# Altium project Thrust Stand + Wind Tunnel Controller.PrjPcb
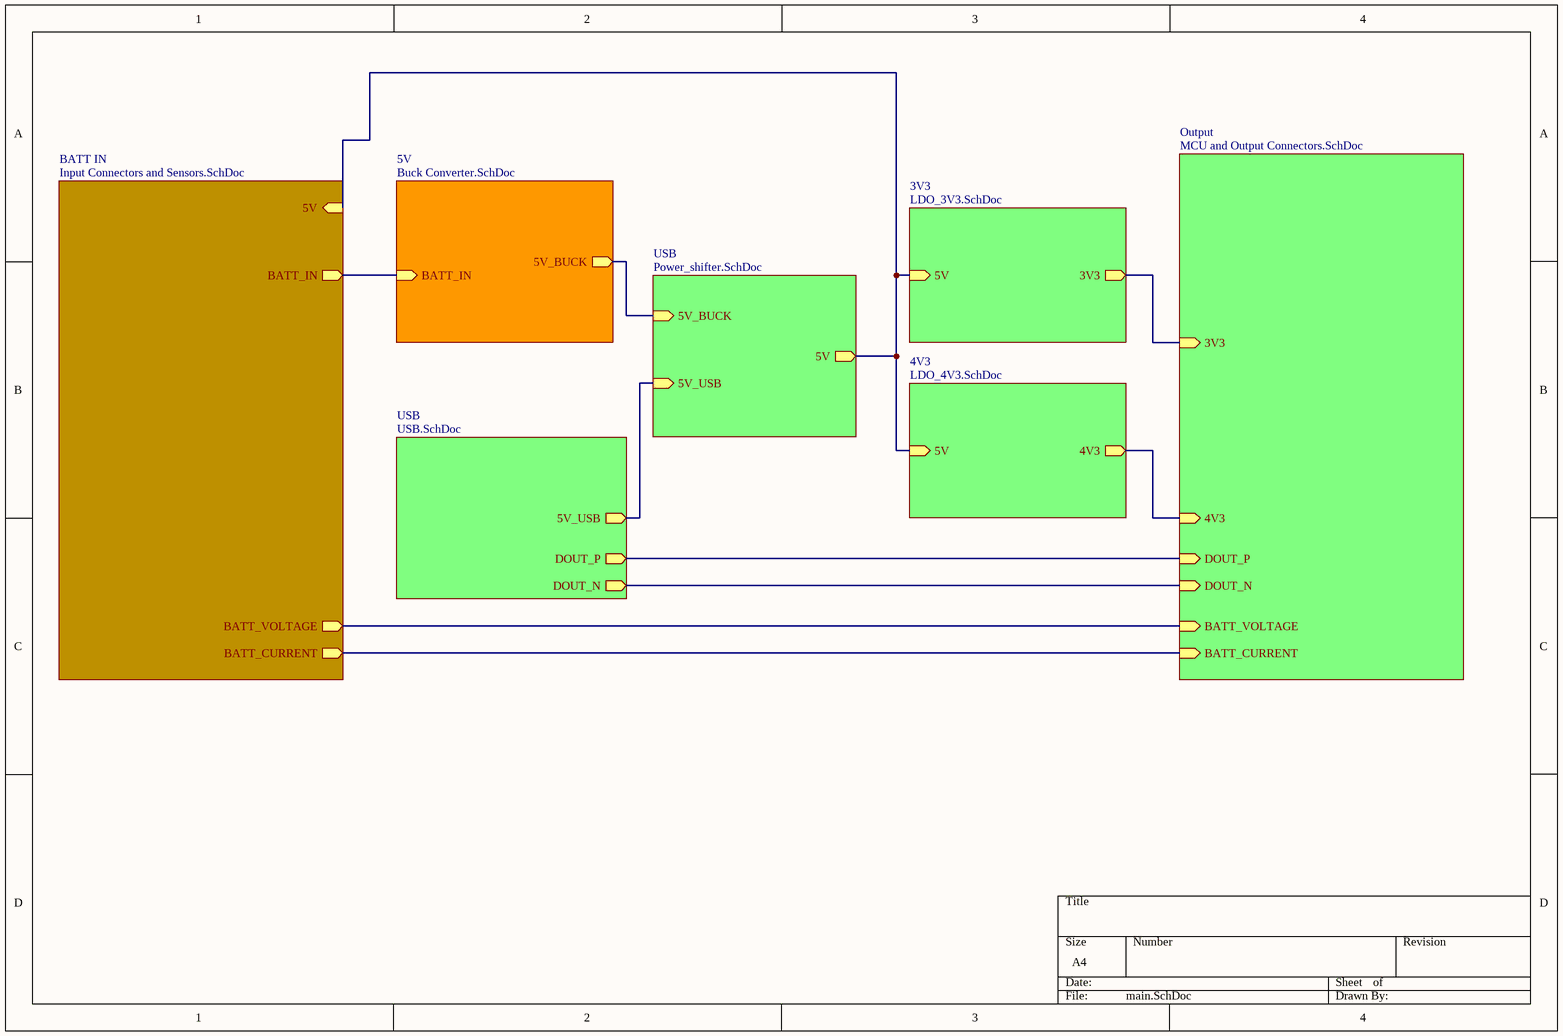
[diagram p0: main.SchDoc]
8 sheets, 159 parts. Net scope: hierarchical (ports join the sheet entries above them; power ports are global).
Board file: Thrust Stand + Wind Tunnel Controller.PcbDoc
Sheets:
  main.SchDoc
    BATT IN = Input Connectors and Sensors.SchDoc
    5V = Buck Converter.SchDoc
    3V3 = LDO_3V3.SchDoc
    Output = MCU and Output Connectors.SchDoc
    4V3 = LDO_4V3.SchDoc
    USB = USB.SchDoc
    USB = Power_shifter.SchDoc

## Sheet main.SchDoc
size A4; SheetNumber: 1; SheetTotal: 7

### Sub-sheets
3V3 = LDO_3V3.SchDoc: 5V (in), 3V3 (out)
4V3 = LDO_4V3.SchDoc: 5V (in), 4V3 (out)
5V = Buck Converter.SchDoc: BATT_IN (in), 5V_BUCK (out)
BATT IN = Input Connectors and Sensors.SchDoc: BATT_IN (out), 5V (in), BATT_CURRENT (out), BATT_VOLTAGE (out)
Output = MCU and Output Connectors.SchDoc: 3V3 (in), 4V3 (in), BATT_CURRENT (in), BATT_VOLTAGE (in), DOUT_P (in), DOUT_N (in)
USB = USB.SchDoc: 5V_USB (out), DOUT_P (out), DOUT_N (out)
USB = Power_shifter.SchDoc: 5V_USB (in), 5V_BUCK (in), 5V (out)

### Nets
3V3: sheet 3V3/3V3, sheet Output/3V3
4V3: sheet Output/4V3, sheet 4V3/4V3
5V: sheet BATT IN/5V, sheet 3V3/5V, sheet 4V3/5V, sheet USB/5V
5V_BUCK: sheet 5V/5V_BUCK, sheet USB/5V_BUCK
5V_USB: sheet USB/5V_USB, sheet USB/5V_USB
BATT_CURRENT: sheet BATT IN/BATT_CURRENT, sheet Output/BATT_CURRENT
BATT_IN: sheet BATT IN/BATT_IN, sheet 5V/BATT_IN
BATT_VOLTAGE: sheet BATT IN/BATT_VOLTAGE, sheet Output/BATT_VOLTAGE
DOUT_N: sheet Output/DOUT_N, sheet USB/DOUT_N
DOUT_P: sheet Output/DOUT_P, sheet USB/DOUT_P

## Sheet Input Connectors and Sensors.SchDoc
size A4; SheetNumber: 2; SheetTotal: 8; SPICEModelCacheJCJFNBCI: <root> / <DocumentId>JCJFNBCI</DocumentId> / <CacheFrame Number="0"> / <Model Name="res" Kind="MDL"> / <Text>*Default semiconductor resistor / .MODEL RES R()</Text> / </Model> / <Model Name="cap" Kind="MDL"> / <Text>*Default semiconductor capacitor / .MODEL CAP C()</Text> / </Model> / </CacheFrame> / </root>
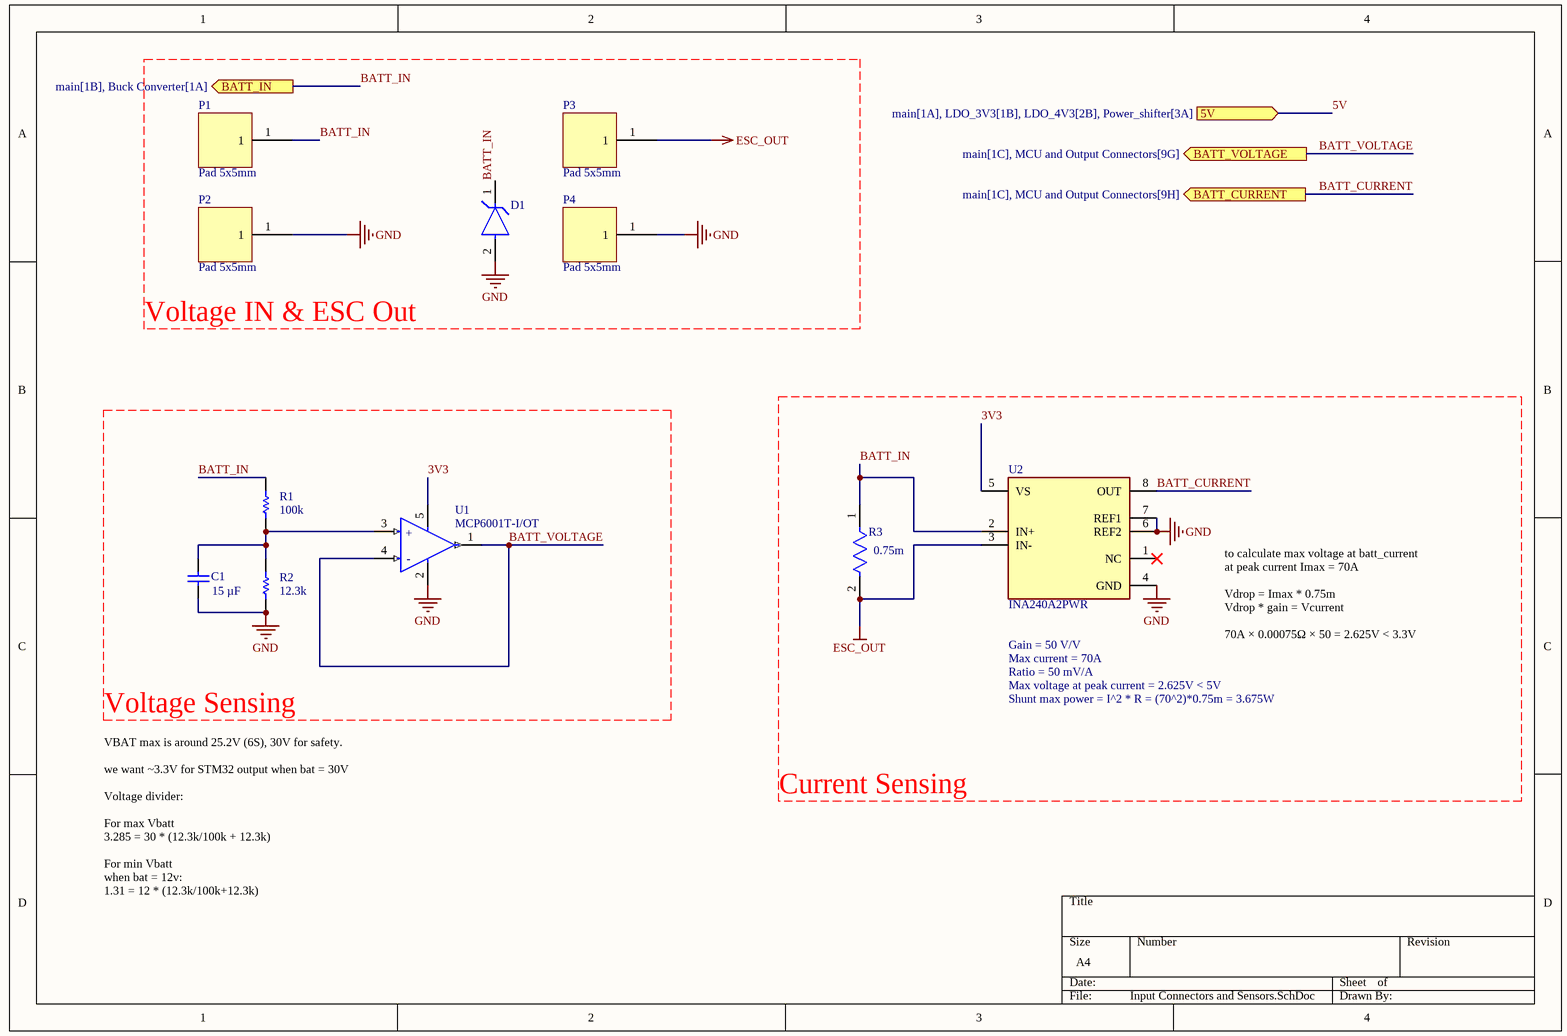
[diagram p1: Input Connectors and Sensors.SchDoc]

### Parts
C1  value 15 µF  [0603_CAPC1608L]  (hidden comment: Cap Semi)
D1  1.5SMC30AHE3_A/H  [FP-SMC-MFG]  (value not drawn)
P1  Pad 5x5mm  [PAD 5X5MM]
P2  Pad 5x5mm  [PAD 5X5MM]
P3  Pad 5x5mm  [PAD 5X5MM]
P4  Pad 5x5mm  [PAD 5X5MM]
R1  value 100k  [0402_RESC1005L]  (hidden comment: Res Semi)
R2  value 12.3k  [0402_RESC1005L]  (hidden comment: Res Semi)
R3  Resistance: 0.75m  [FP-AC2512-MFG]  (hidden comment: SCMM2512S5-R001F)
U1  MCP6001T-I/OT  [FP-C04-091-OT-IPC_A]
U2  INA240A2PWR  [FP-PW0008A-MFG]

### Ports
5V (in, see main[1A], LDO_3V3[1B], LDO_4V3[2B], Power_shifter[3A]), BATT_CURRENT (out, see main[1C], MCU and Output Connectors[9H]), BATT_IN (out, see main[1B], Buck Converter[1A]), BATT_VOLTAGE (out, see main[1C], MCU and Output Connectors[9G])

### Nets
ESC_OUT: P3.1 R3.2 U2.3(IN-)
GND: C1.1 D1.2(A) P2.1 P4.1 R2.1 U1.2(VSS) U2.4(GND) U2.6(REF2) U2.7(REF1)
3V3: U1.5(VDD) U2.5(VS)
BATT_CURRENT: U2.8(OUT) ; port BATT_CURRENT
BATT_IN: D1.1(C) P1.1 R1.2 R3.1 U2.2(IN+) ; port BATT_IN
BATT_VOLTAGE: U1.1(VOUT) U1.4(VIN-) ; port BATT_VOLTAGE
NetC1_2: C1.2 R1.1 R2.2 U1.3(VIN+)

Not connected (* = marked no-connect by the designer): U2 1(NC)*

### Notes on the sheet
- Voltage IN & ESC Out
- Gain = 50 V/V
- Voltage Sensing
- Max current = 70A
- Ratio = 50 mV/A
- Max voltage at peak current = 2.625V < 5V
- Shunt max power = I^2 * R = (70^2)*0.75m = 3.675W
- to calculate max voltage at batt_current at peak current Imax = 70A
  Vdrop = Imax * 0.75m
  Vdrop * gain = Vcurrent
  70A × 0.00075Ω × 50 = 2.625V < 3.3V
- Current Sensing
- VBAT max is around 25.2V (6S), 30V for safety.
  we want ~3.3V for STM32 output when bat = 30V
  Voltage divider:
  For max Vbatt
  3.285 = 30 * (12.3k/100k + 12.3k)
  For min Vbatt
  when bat = 12v:
  1.31 = 12 * (12.3k/100k+12.3k)
- (in symbol CMP-0187-00462-3) +; -

### Library data of the parts
C1 = Cap Semi: Capacitor (Semiconductor SIM Model); Published: 8-Jun-2000; LatestRevisionDate: 29-May-2009; LatestRevisionNote: IPC-7351 Footprint Added.; PackageReference: C1206; Publisher: Altium Limited; PackageDescription: Chip Capacitor; Digikey part#: *; Manufacturer: *; Manufacturer part#: *
D1 = CMP-02577-000023-1: TVS DIODE 25.6VWM 41.4VC SMC
R1 R2 = Res Semi: Semiconductor Resistor; Published: 8-Jun-2000; LatestRevisionDate: 17-Jul-2002; LatestRevisionNote: Re-released for DXP Platform.; PackageReference: AXIAL-0.5; Publisher: Altium Limited; Digikey part#: *; Manufacturer: *; Manufacturer part#: *
R3 = CMP-03412-007688-1: RES 0.001 OHM 1% 5W 2512; Manufacturer Part Number: AC2512JK-072K4L; Manufacturer: Yageo; Power Rating: 1W; Tolerance: 0.05; Voltage Rating: 200V; Value: 1mΩ; Automotive Grade: Grade 0; ComponentLink2Description: Datasheet; Height: 0.65mm; Octopart: https://octopart.com/ac2512jk-072k4l-yageo-71370358; Automotive: Yes; Device Class L3: Chip SMD Resistors; Device Class L1: Passive Components; Category: Res; Temperature Range Low: -55°C; Digikey Description: RES SMD 2.4K OHM 5% 1W 2512; Temperature: -55°C to +155°C; Package: AC2512; Lead Free: Yes; Footprint Url: http://www.yageo.com/exep/pages/download/literatures/PYu-R_Mount_10.pdf; Series: AC; Device Class L2: Resistors; Composition: Thick Film; ComponentLink2URL: http://www.yageo.com/documents/recent/PYu-AC_51_RoHS_L_6.pdf; Temperature Range High: +155°C; RoHS: TRUE; Ipc Land Pattern Name: RESC635310X55
U1 = CMP-0187-00462-3: IC OPAMP GP 1 CIRCUIT SOT23-5; Number of Amplifiers: 1; Voltage: 6V; Power Supply Rejection Ratio (PSRR): 86dB; Common Mode Rejection Ratio: 60dB; Unity Gain Bandwidth Product: 1MHz; Slew Rate: 0.6V/µs; Output Current per Channel: 23mA; Nominal Supply Current: 100uA; Input Offset Voltage (Vos): 4.5mV; Input Bias Current: 1pA; Operating Supply Voltage: 5.5V; Min Supply Voltage: 1.8V; Voltage Gain: 112dB; Length: 3.1mm; REACH SVHC: No SVHC; Number of Pins: 5; Package Quantity: 1; Radiation Hardening: No; Mount: Surface Mount; Number of Circuits: 1; Number of Elements: 1; Output Current: 23mA; Packaging: Tape and Reel; Height: 1.3mm; Lead Free: Lead Free; Min Operating Temperature: -40°C; Bandwidth: 1MHz; Contact Plating: Tin; Max Supply Voltage: 6V; Max Operating Temperature: 85°C; Width: 1.8mm; Case/Package: SOT-23; Operating Supply Current: 100uA; Number of Channels: 1; Gain Bandwidth Product: 1MHz
U2 = CMP-04895-000047-1: IC AMP CURRENT SENSE 8-TSSOP; Manufacturer: Texas Instruments; Voltage Gain: 0.05V/mV; Max Supply Voltage: 5.5V; Max Junction Temp: +150°C; Input Offset Voltage: 0.005mV; Bandwidth: 400kHz; Min Supply Voltage: 2.7V; Nominal Supply Current: 1.8mA; Standoff Height: 0.05mm; Number Of Channels: 1; Input Bias Current: 90uA; ComponentLink2URL: http://www.ti.com/lit/ds/symlink/ina240.pdf; Device Class L2: Linear ICs; ComponentLink2Description: Datasheet; Temperature: -40°C to +125°C; Octopart: https://octopart.com/ina240a2pwr-texas+instruments-75431049; Automotive: No; Manufacturer Part Number: INA240A2PWR; Ambient Temperature Range Low: -40°C; RoHS: TRUE; Package: PW0008A; Device Class L1: Integrated Circuits (ICs); Temperature Range Low: -40°C; Category: IC; Ipc Land Pattern Name: SOP65P300X120-8; Temperature Range High: +125°C; Ambient Temperature Range High: +125°C; Height: 1.2mm; Lead Free: Yes; Device Class L3: Instrumentation; Digikey Description: IC AMP CURRENT SENSE 8-TSSOP

## Sheet Buck Converter.SchDoc
size 457 x 241 mm; SheetNumber: 3; SheetTotal: 7; SPICEModelCacheVIQWTICF: <root> / <DocumentId>VIQWTICF</DocumentId> / <CacheFrame Number="0"> / <Model Name="cap" Kind="MDL"> / <Text>*Default semiconductor capacitor / .MODEL CAP C()</Text> / </Model> / <Model Name="res" Kind="MDL"> / <Text>*Default semiconductor resistor / .MODEL RES R()</Text> / </Model> / </CacheFrame> / </root>
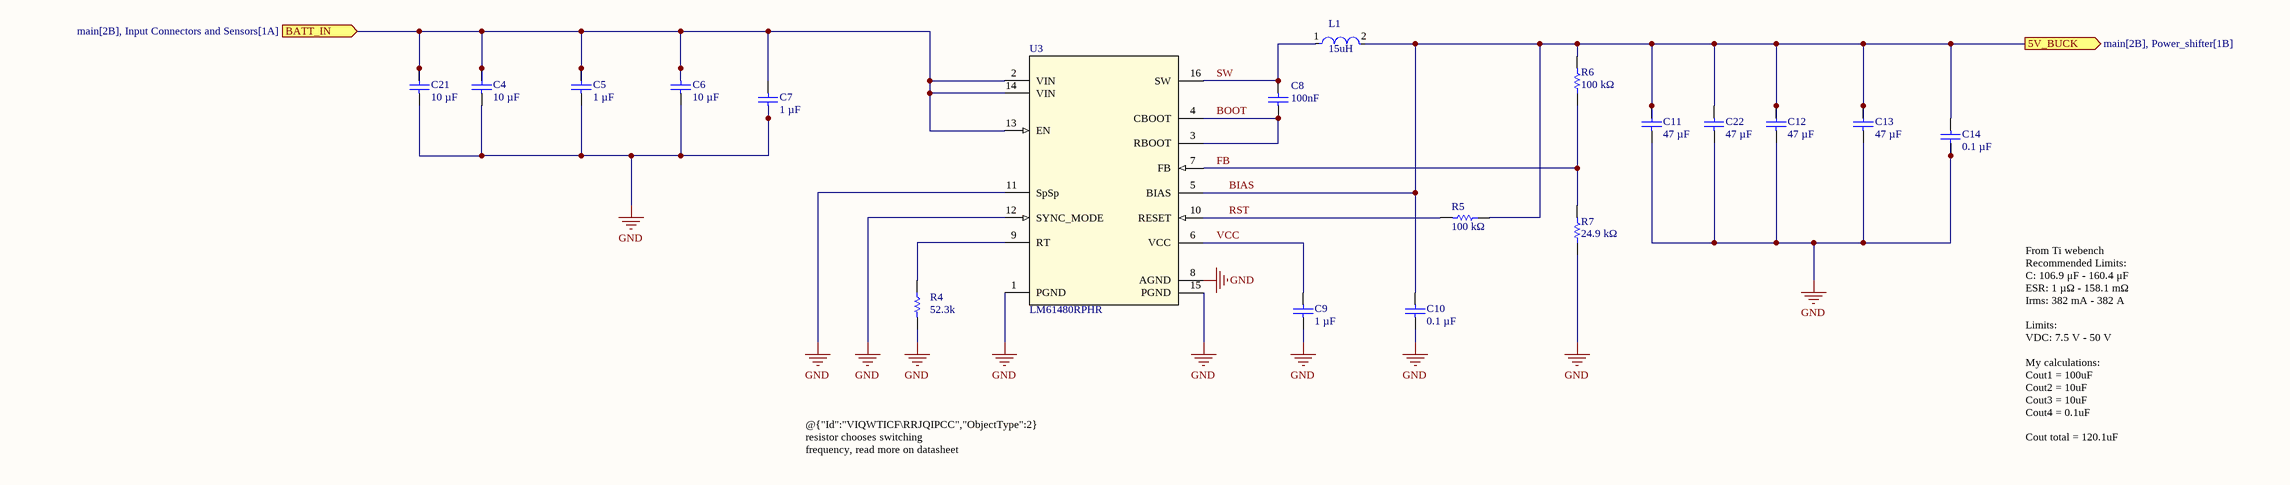
[diagram p2: Buck Converter.SchDoc]

### Parts
C4  10 µF  [1210_CAPC3225L]
C5  1 µF  [0603_CAPC1608L]
C6  10 µF  [1210_CAPC3225L]
C7  1 µF  [0603_CAPC1608L]
C8  Capacitance: 100nF  [CAPC1005X55X25LL05T10]  (hidden comment: GRM155R71A104KA01D)
C9  1 µF  [0603_CAPC1608L]
C10  0.1 µF  [0402_CAPC1005L]
C11  47 µF  [1210_CAPC3225L]
C12  47 µF  [1210_CAPC3225L]
C13  47 µF  [1210_CAPC3225L]
C14  0.1 µF  [0402_CAPC1005L]
C21  10 µF  [1210_CAPC3225L]
C22  47 µF  [1210_CAPC3225L]
L1  Inductance: 15uH  [FP-SRR1260-MFG]  (hidden comment: SRR1260-150M)
R4  Resistance: 52.3k  [RESC1005X40X25LL05T05]  (hidden comment: CRCW040252K3FKED)
R5  value 100 kΩ  [0603_RESC1608L]  (hidden comment: Res Semi)
R6  value 100 kΩ  [0603_RESC1608L]  (hidden comment: Res Semi)
R7  value 24.9 kΩ  [0603_RESC1608L]  (hidden comment: Res Semi)
U3  LM61480RPHR  [RPH0016A]

### Ports
5V_BUCK (out, see main[2B], Power_shifter[1B]), BATT_IN (in, see main[2B], Input Connectors and Sensors[1A])

### Nets
GND: C4.2 C5.2 C6.2 C7.2 C9.2 C10.2 C11.2 C12.2 C13.2 C14.2 C21.2 C22.2 R4.2 R7.1 U3.1(PGND) U3.8(AGND) U3.11(SpSp) U3.12(SYNC_MODE) U3.15(PGND)
BATT_IN: C4.1 C5.1 C6.1 C7.1 C21.1 U3.2(VIN) U3.13(EN) U3.14(VIN) ; port BATT_IN
BIAS: C10.1 C11.1 C12.1 C13.1 C14.1 C22.1 L1.2 R5.1 R6.2 U3.5(BIAS) ; port 5V_BUCK  [project net 5V_BUCK]
BOOT: C8.2 U3.3(RBOOT) U3.4(CBOOT)
FB: R6.1 R7.2 U3.7(FB)
RST: R5.2 U3.10(RESET)
SW: C8.1 L1.1 U3.16(SW)
VCC: C9.1 U3.6(VCC)
NetR4_1: R4.1 U3.9(RT)

### Notes on the sheet
- @{"Id":"VIQWTICF\RRJQIPCC","ObjectType":2} resistor chooses switching frequency, read more on datasheet
- From Ti webench
  Recommended Limits:
  C: 106.9 μF - 160.4 μF
  ESR: 1 µΩ - 158.1 mΩ
  Irms: 382 mA - 382 A
  Limits:
  VDC: 7.5 V - 50 V
  My calculations:
  Cout1 = 100uF
  Cout2 = 10uF
  Cout3 = 10uF
  Cout4 = 0.1uF
  Cout total = 120.1uF

### Library data of the parts
C4-C7 C9-C14 C21 C22 = Cap Semi: Capacitor (Semiconductor SIM Model); Published: 8-Jun-2000; LatestRevisionDate: 29-May-2009; LatestRevisionNote: IPC-7351 Footprint Added.; PackageReference: C1206; Publisher: Altium Limited; PackageDescription: Chip Capacitor; Digikey part#: *; Manufacturer: *; Manufacturer part#: *
  C4 C6 C21: Value: 10 µF
  C5 C7 C9: Value: 1 µF
  C10 C14: Value: 0.1 µF
  C11-C13 C22: Value: 47 µF
C8 = CMP-2000-06331-1: Chip Capacitor, 0.1 uF, +/- 10%, 10 V, -55 to 125 degC, 0402 (1005 Metric), RoHS, Tape and Reel; Manufacturer: Murata; Rated Voltage: 10V; Dielectric: X7R; Value: 100nF; Manufacturer URL: http://www.murata.com/; Datasheet Version: 02/2016; Datasheet URL: http://search.murata.co.jp/Ceramy/image/img/A01X/G101/ENG/GRM155R71A104KA01-01.pdf; Package Reference: 0402; Tolerance (%): ±10%; Package Description: 2-Pin Surface Mount Device, Body 1 x 0.5 mm; Mounting Technology: SurfaceMount; Case Size/Dimension: 0402
L1 = CMP-2000-07146-2: FIXED IND 15UH 5A 27 MOHM SMD; Q Factor: 25; Sample Rate (Hz): 100kHz; Resistance: 27MR; Material: Steel; Inductance Tolerance: 20%; Frequency: 17.6MHz; Saturation Current: 4.6A; Core Material: Ferrite; Shielding: Shielded; Series: SRR1260; Termination: SMD/SMT; Packaging: Tape and Reel; RoHS Compliant: Yes; Height - Seated (Max): 0.256inch; Depth: 12.8mm; Case/Package: 1260; Height: 6mm; Number of Pins: 2; Mount: Surface Mount; Min Operating Temperature: -40°C; Test Frequency: 100kHz; Length: 12.5mm; Self Resonant Frequency: 17.6MHz; Current Rating: 5A; Tolerance: 20%; RMS Current (Irms): 5A; REACH SVHC: No SVHC; Resistor Type: Wirewound; DC Resistance (DCR): 27mR; Width: 12.5mm; Package Quantity: 600; DC Current: 5A; Max DC Current: 5A; Max Operating Temperature: 125°C; Military Standard: Not; Value: 15uH; Parameter 1: *
R4 = CMP-2002-00086-1: Manufacturer: Vishay Dale; Part Number: CRCW040252K3FKED
R5-R7 = Res Semi: Semiconductor Resistor; Published: 8-Jun-2000; LatestRevisionDate: 17-Jul-2002; LatestRevisionNote: Re-released for DXP Platform.; PackageReference: AXIAL-0.5; Publisher: Altium Limited; Digikey part#: *; Manufacturer: *; Manufacturer part#: *
U3 = LM61480RPHR: 8-A buck converter optimized for power density and low EMI 16-VQFN-HR -40 to 150; Manufacturer_Name: Texas Instruments; TYPE: TYPE; RefDes: RefDes; Copyright: Copyright (C) 2026 Ultra Librarian. All rights reserved.; Manufacturer_Part_Number: LM61480RPHR

## Sheet LDO_3V3.SchDoc
size A4; SheetNumber: 6; SheetTotal: 8; SPICEModelCacheBPWODVRE: <root> / <DocumentId>BPWODVRE</DocumentId> / <CacheFrame Number="0"> / <Model Name="res" Kind="MDL"> / <Text>*Default semiconductor resistor / .MODEL RES R()</Text> / </Model> / <Model Name="cap" Kind="MDL"> / <Text>*Default semiconductor capacitor / .MODEL CAP C()</Text> / </Model> / </CacheFrame> / </root>
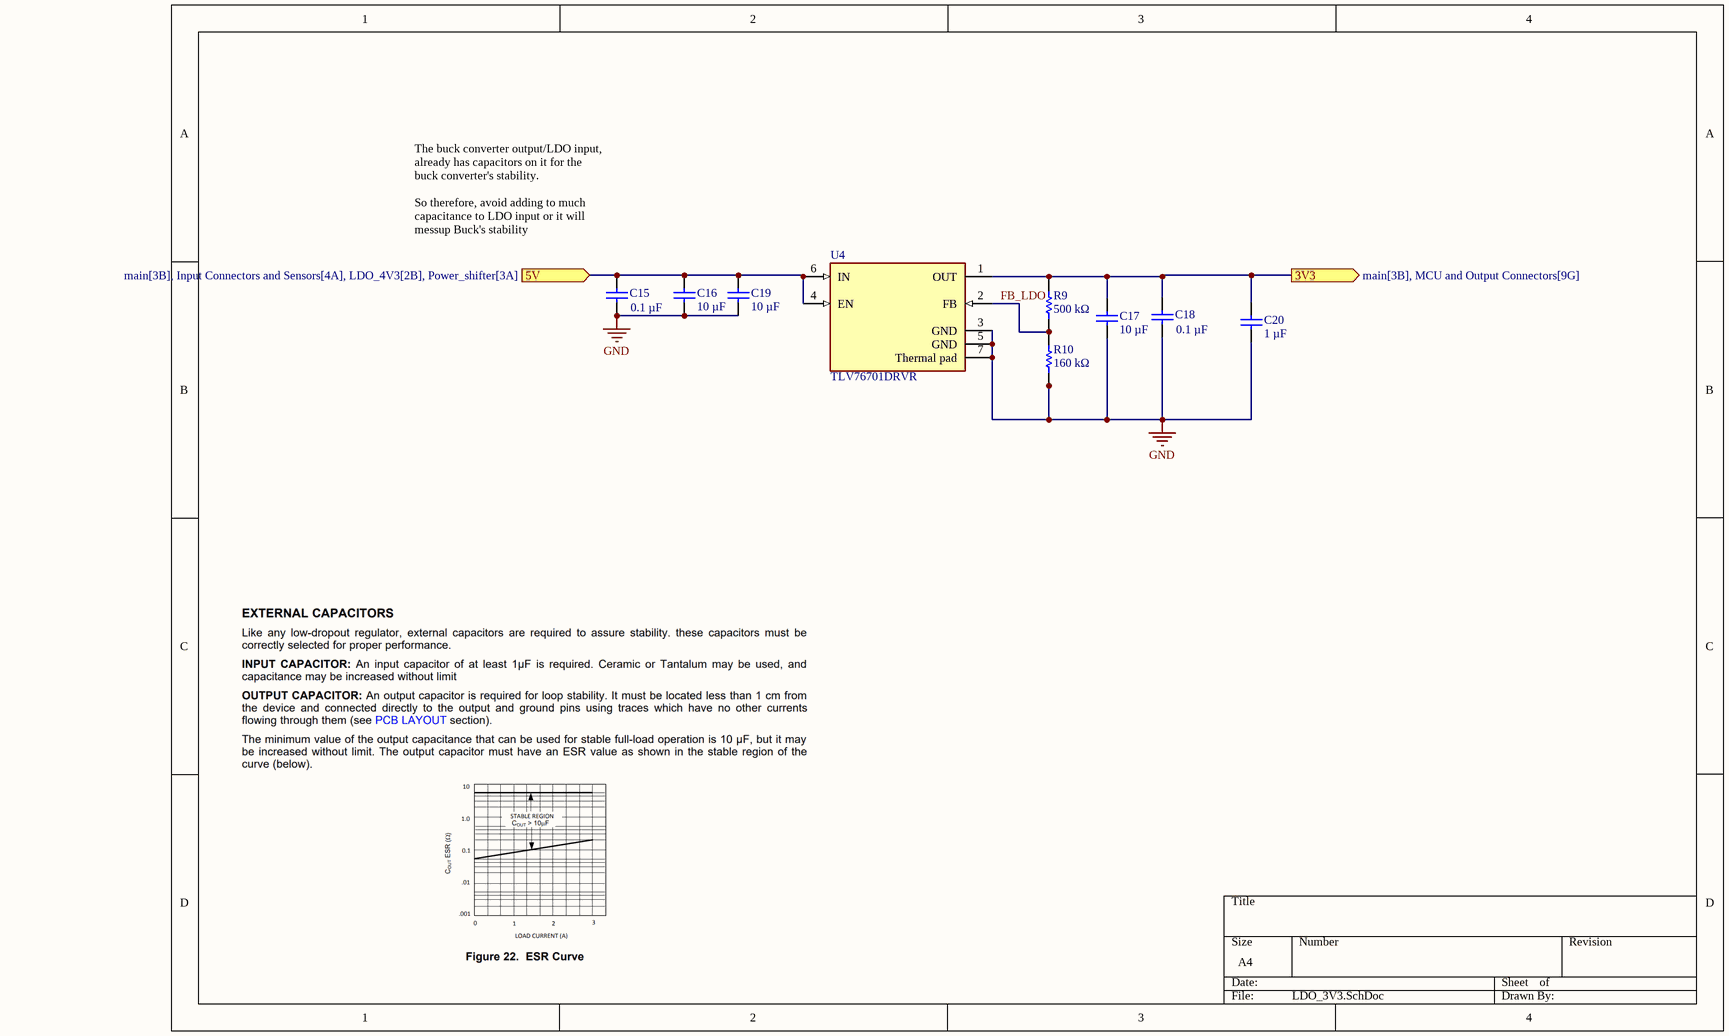
[diagram p3: LDO_3V3.SchDoc]

### Parts
C15  0.1 µF  [0402_CAPC1005L]
C16  10 µF  [1210_CAPC3225L]
C17  10 µF  [1210_CAPC3225L]
C18  0.1 µF  [0402_CAPC1005L]
C19  10 µF  [1210_CAPC3225L]
C20  1 µF  [0603_CAPC1608L]
R9  value 500 kΩ  [0402_RESC1005L]  (hidden comment: Res Semi)
R10  value 160 kΩ  [0402_RESC1005L]  (hidden comment: Res Semi)
U4  TLV76701DRVR  [FP-DRV0006A-IPC_C]

### Ports
3V3 (out, see main[3B], MCU and Output Connectors[9G]), 5V (in, see main[3B], Input Connectors and Sensors[4A], LDO_4V3[2B], Power_shifter[3A])

### Nets
GND: C15.1 C16.2 C17.2 C18.1 C19.2 C20.2 R10.1 U4.3(GND) U4.5(GND) U4.7(Thermal_pad)
3V3: C17.1 C18.2 C20.1 R9.2 U4.1(OUT) ; port 3V3
5V: C15.2 C16.1 C19.1 U4.4(EN) U4.6(IN) ; port 5V
FB_LDO: R9.1 R10.2 U4.2(FB)

### Notes on the sheet
- The buck converter output/LDO input, already has capacitors on it for the buck converter's stability.
  So therefore, avoid adding to much capacitance to LDO input or it will messup Buck's stability

### Library data of the parts
C15-C20 = Cap Semi: Capacitor (Semiconductor SIM Model); Published: 8-Jun-2000; LatestRevisionDate: 29-May-2009; LatestRevisionNote: IPC-7351 Footprint Added.; PackageReference: C1206; Publisher: Altium Limited; PackageDescription: Chip Capacitor; Digikey part#: *; Manufacturer: *; Manufacturer part#: *
  C15 C18: Value: 0.1 µF
  C16 C17 C19: Value: 10 µF
  C20: Value: 1 µF
R9 R10 = Res Semi: Semiconductor Resistor; Published: 8-Jun-2000; LatestRevisionDate: 17-Jul-2002; LatestRevisionNote: Re-released for DXP Platform.; PackageReference: AXIAL-0.5; Publisher: Altium Limited; Digikey part#: *; Manufacturer: *; Manufacturer part#: *
U4 = CMP-04917-000172-1: IC REG LINEAR POS ADJ 1A 6WSON

## Sheet MCU and Output Connectors.SchDoc
size 558 x 431 mm; SheetNumber: 8; SheetTotal: 8; SPICEModelCacheSEVJLARZ: <root> / <DocumentId>SEVJLARZ</DocumentId> / <CacheFrame Number="0"> / <Model Name="cap" Kind="MDL"> / <Text>*Default semiconductor capacitor / .MODEL CAP C()</Text> / </Model> / <Model Name="res" Kind="MDL"> / <Text>*Default semiconductor resistor / .MODEL RES R()</Text> / </Model> / </CacheFrame> / </root>
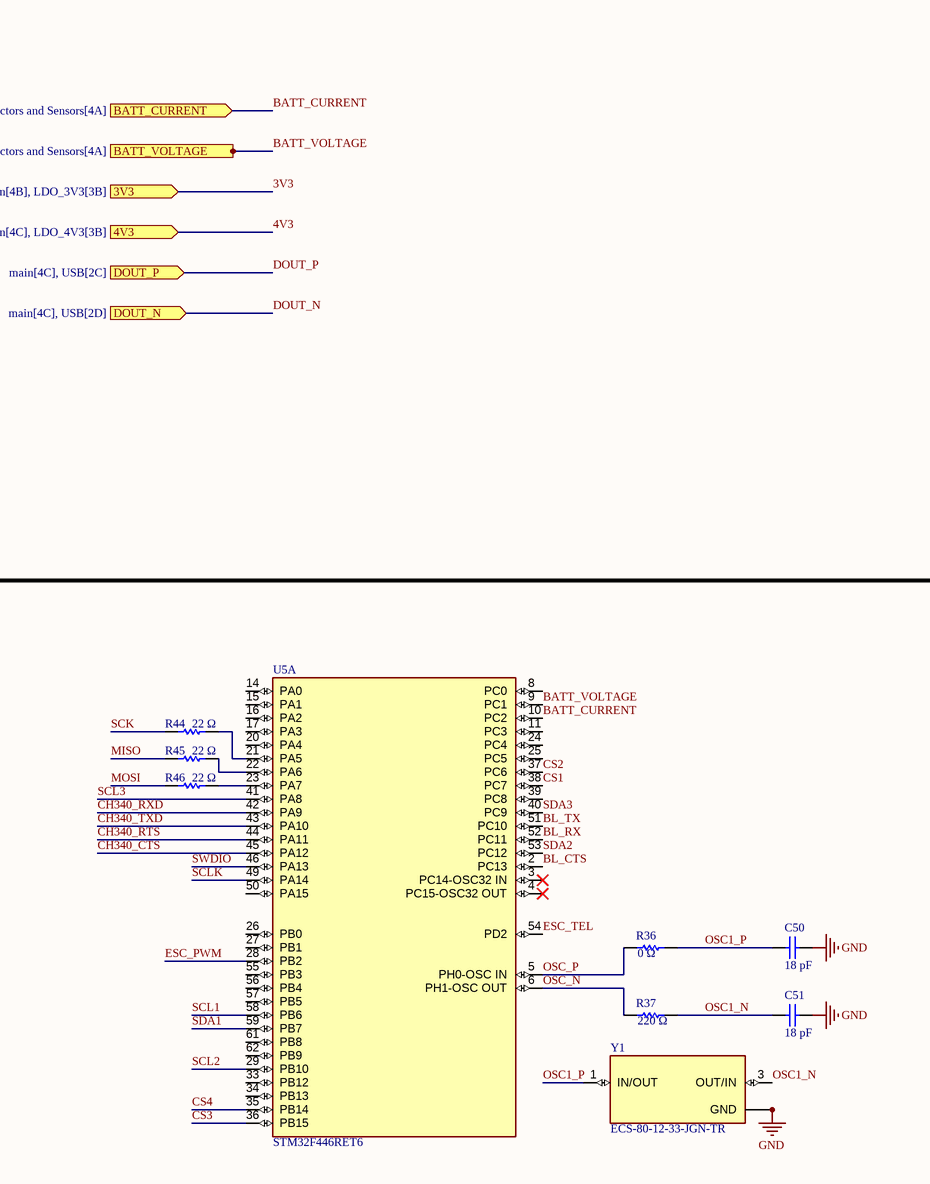
[diagram p4: MCU and Output Connectors.SchDoc, top left]
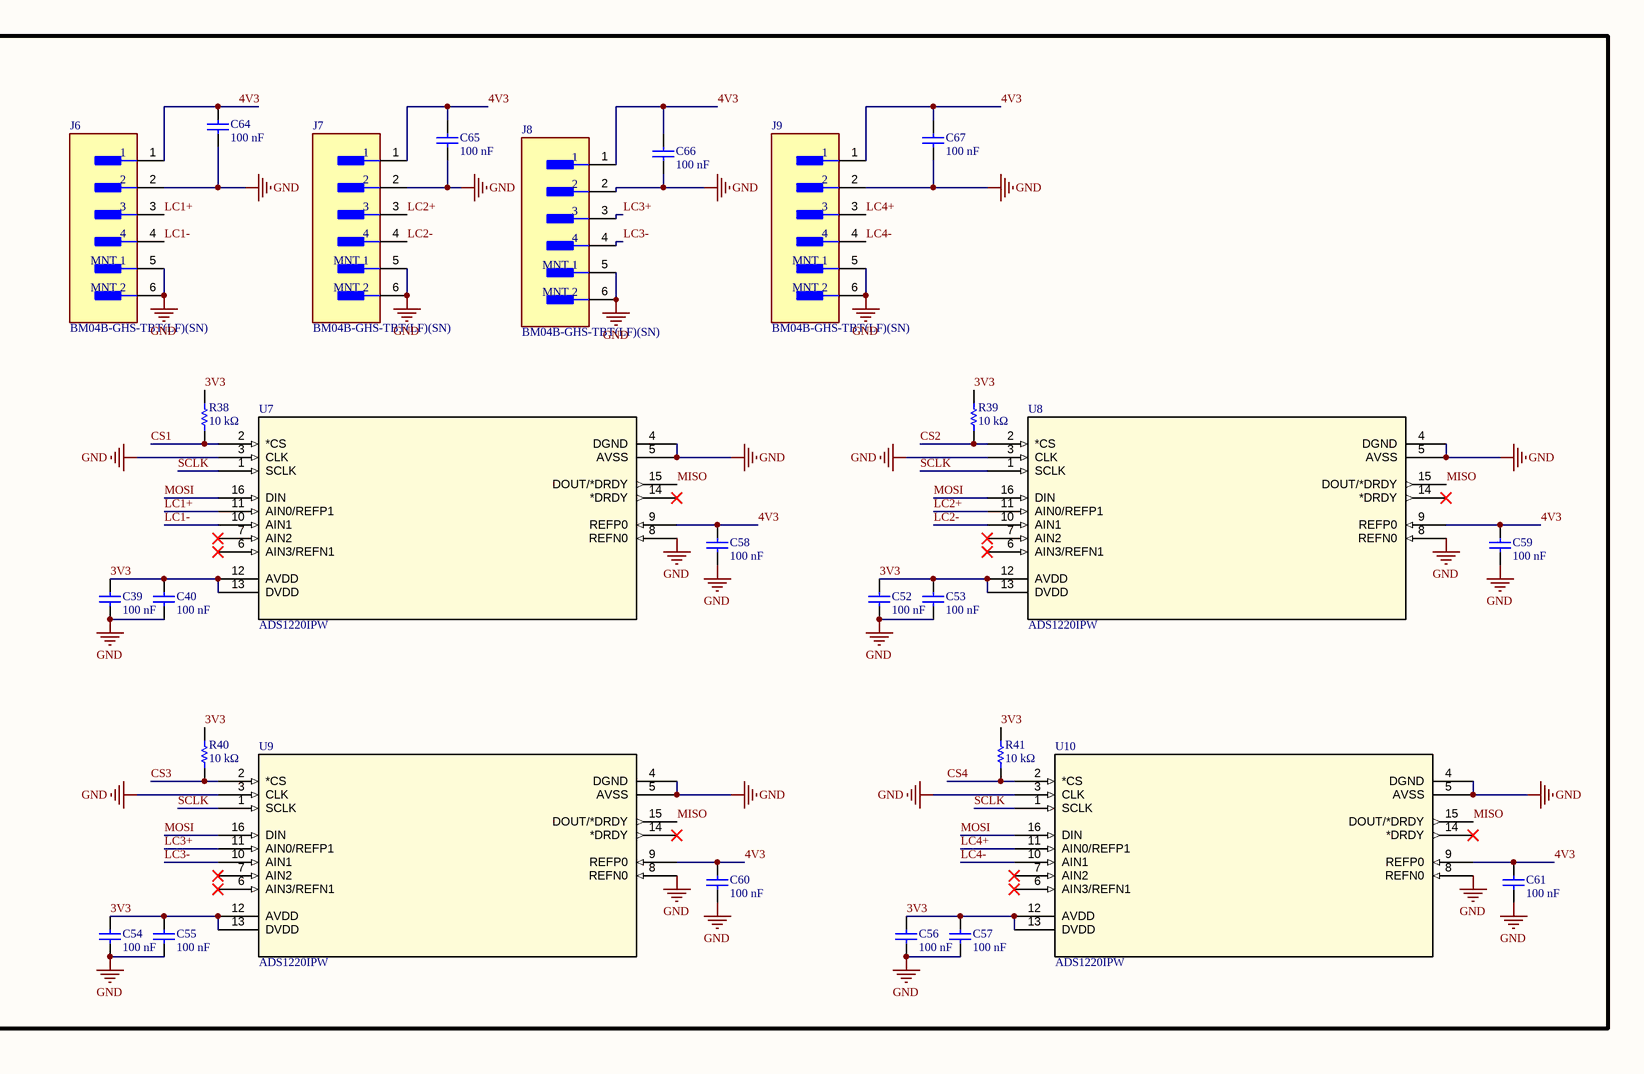
[diagram p5: MCU and Output Connectors.SchDoc, top right]
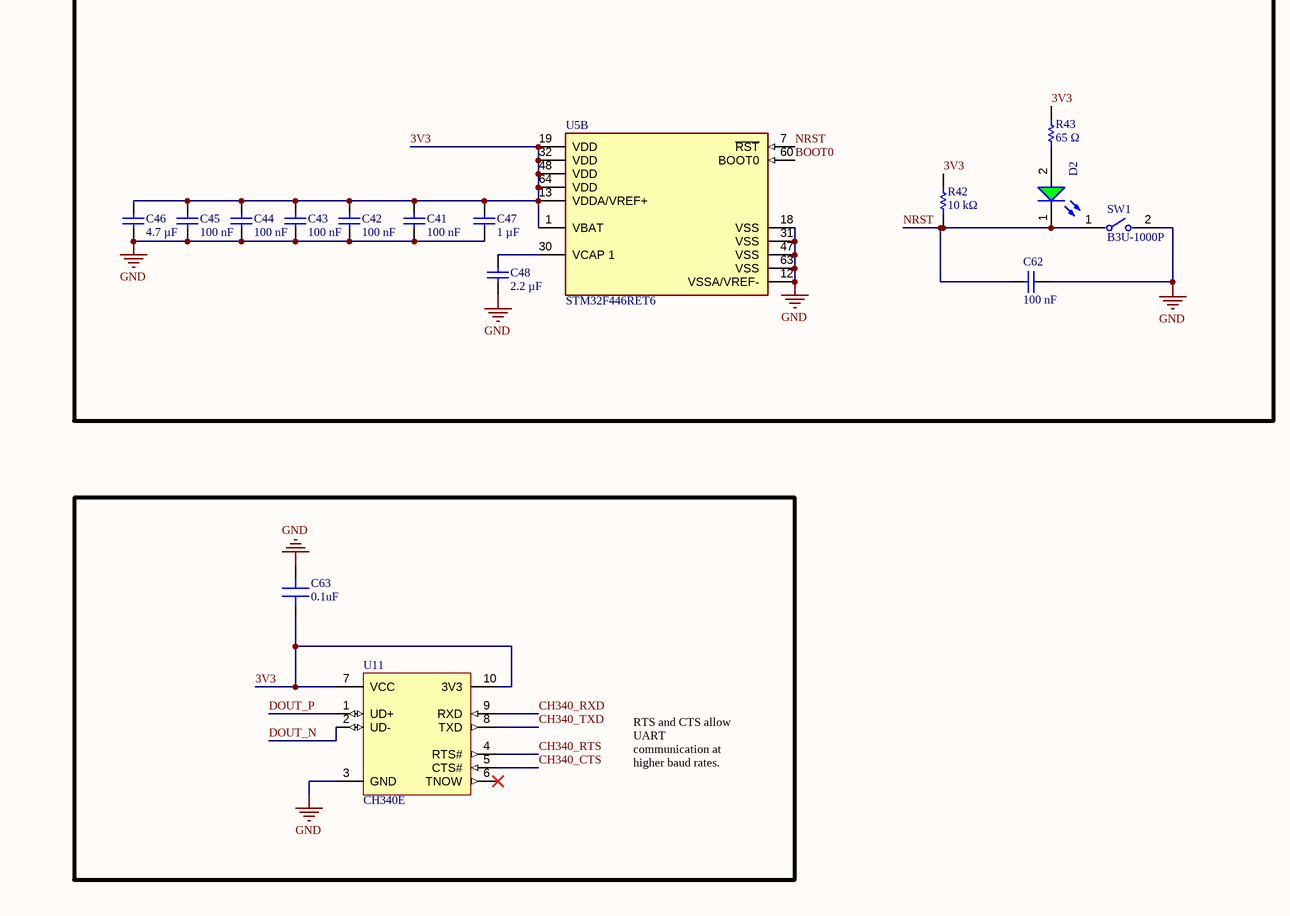
[diagram p6: MCU and Output Connectors.SchDoc, bottom left]
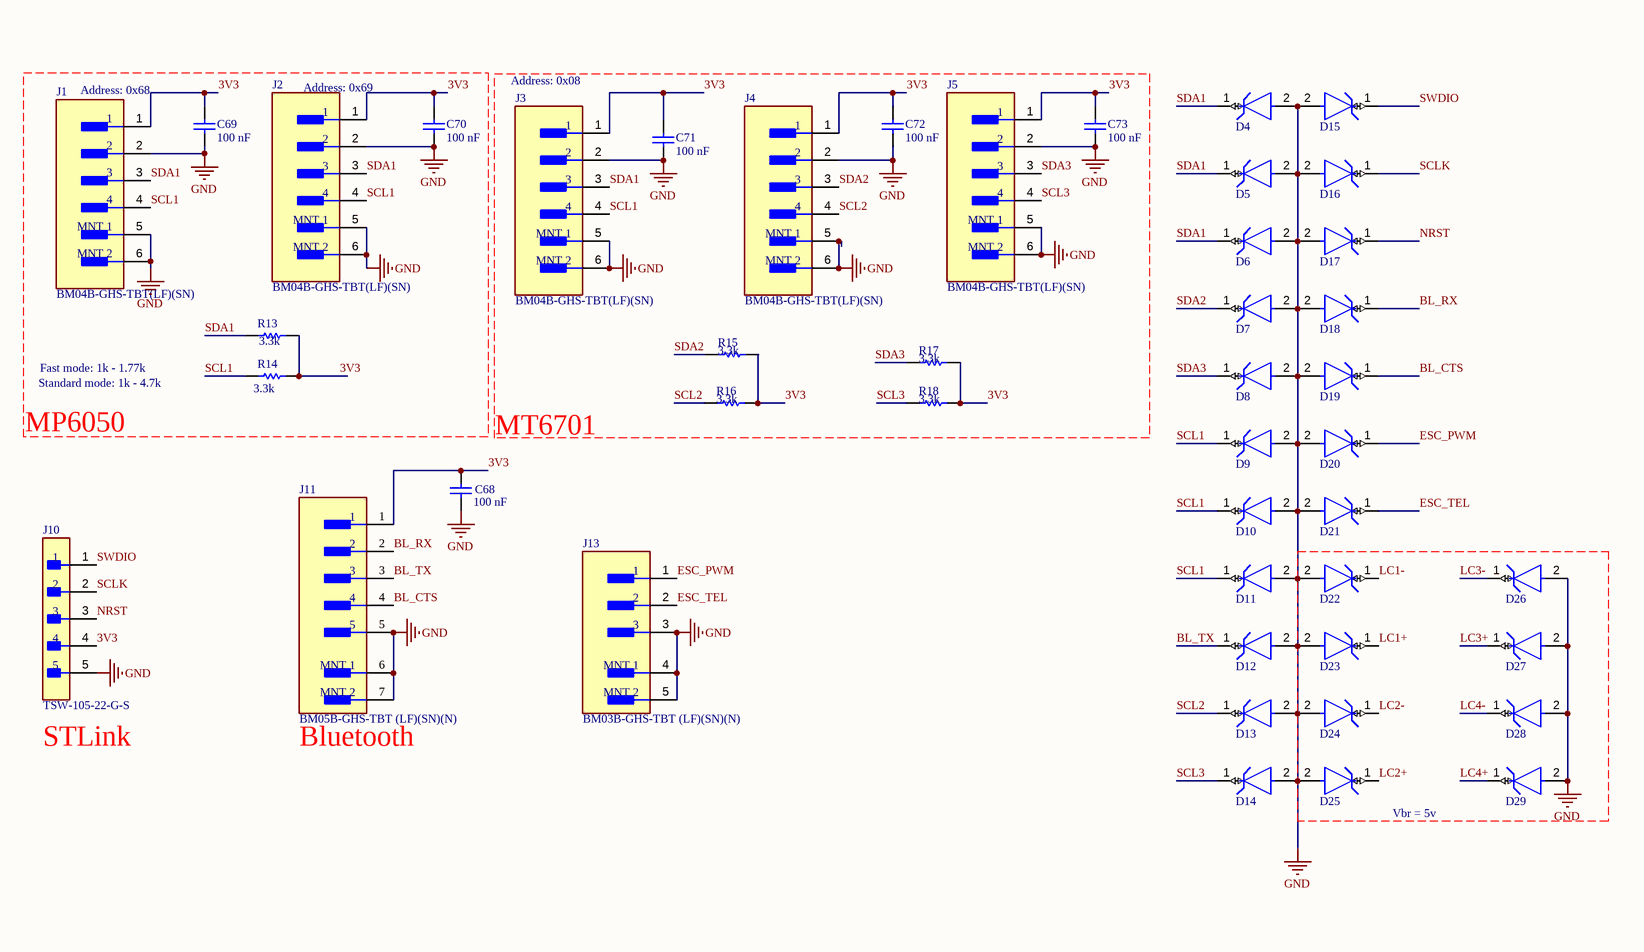
[diagram p7: MCU and Output Connectors.SchDoc, bottom right]

### Parts
C39  value 100 nF  [0402_CAPC1005L]  (hidden comment: Cap Semi)
C40  value 100 nF  [0402_CAPC1005L]  (hidden comment: Cap Semi)
C41  value 100 nF  [0402_CAPC1005L]  (hidden comment: Cap Semi)
C42  value 100 nF  [0402_CAPC1005L]  (hidden comment: Cap Semi)
C43  value 100 nF  [0402_CAPC1005L]  (hidden comment: Cap Semi)
C44  value 100 nF  [0402_CAPC1005L]  (hidden comment: Cap Semi)
C45  value 100 nF  [0402_CAPC1005L]  (hidden comment: Cap Semi)
C46  value 4.7 µF  [0402_CAPC1005L]  (hidden comment: Cap Semi)
C47  value 1 µF  [0402_CAPC1005L]  (hidden comment: Cap Semi)
C48  value 2.2 µF  [0402_CAPC1005L]  (hidden comment: Cap Semi)
C50  value 18 pF  [0402_CAPC1005L]  (hidden comment: Cap Semi)
C51  value 18 pF  [0402_CAPC1005L]  (hidden comment: Cap Semi)
C52  value 100 nF  [0402_CAPC1005L]  (hidden comment: Cap Semi)
C53  value 100 nF  [0402_CAPC1005L]  (hidden comment: Cap Semi)
C54  value 100 nF  [0402_CAPC1005L]  (hidden comment: Cap Semi)
C55  value 100 nF  [0402_CAPC1005L]  (hidden comment: Cap Semi)
C56  value 100 nF  [0402_CAPC1005L]  (hidden comment: Cap Semi)
C57  value 100 nF  [0402_CAPC1005L]  (hidden comment: Cap Semi)
C58  value 100 nF  [0402_CAPC1005L]  (hidden comment: Cap Semi)
C59  value 100 nF  [0402_CAPC1005L]  (hidden comment: Cap Semi)
C60  value 100 nF  [0402_CAPC1005L]  (hidden comment: Cap Semi)
C61  value 100 nF  [0402_CAPC1005L]  (hidden comment: Cap Semi)
C62  100 nF  [0402_CAPC1005L]
C63  0.1uF  [IPC C C0402 NO SILK]
C64  value 100 nF  [0402_CAPC1005L]  (hidden comment: Cap Semi)
C65  value 100 nF  [0402_CAPC1005L]  (hidden comment: Cap Semi)
C66  value 100 nF  [0402_CAPC1005L]  (hidden comment: Cap Semi)
C67  value 100 nF  [0402_CAPC1005L]  (hidden comment: Cap Semi)
C68  value 100 nF  [0402_CAPC1005L]  (hidden comment: Cap Semi)
C69  value 100 nF  [0402_CAPC1005L]  (hidden comment: Cap Semi)
C70  value 100 nF  [0402_CAPC1005L]  (hidden comment: Cap Semi)
C71  value 100 nF  [0402_CAPC1005L]  (hidden comment: Cap Semi)
C72  value 100 nF  [0402_CAPC1005L]  (hidden comment: Cap Semi)
C73  value 100 nF  [0402_CAPC1005L]  (hidden comment: Cap Semi)
D2  150060VS75000  [WL-SMCW_0603_150060xx75000]  (value not drawn)
D4  ESD321DPYR  [FP-DPY0002A-MFG]  (value not drawn)
D5  ESD321DPYR  [FP-DPY0002A-MFG]  (value not drawn)
D6  ESD321DPYR  [FP-DPY0002A-MFG]  (value not drawn)
D7  ESD321DPYR  [FP-DPY0002A-MFG]  (value not drawn)
D8  ESD321DPYR  [FP-DPY0002A-MFG]  (value not drawn)
D9  ESD321DPYR  [FP-DPY0002A-MFG]  (value not drawn)
D10  ESD321DPYR  [FP-DPY0002A-MFG]  (value not drawn)
D11  ESD321DPYR  [FP-DPY0002A-MFG]  (value not drawn)
D12  ESD321DPYR  [FP-DPY0002A-MFG]  (value not drawn)
D13  ESD321DPYR  [FP-DPY0002A-MFG]  (value not drawn)
D14  ESD321DPYR  [FP-DPY0002A-MFG]  (value not drawn)
D15  ESD321DPYR  [FP-DPY0002A-MFG]  (value not drawn)
D16  ESD321DPYR  [FP-DPY0002A-MFG]  (value not drawn)
D17  ESD321DPYR  [FP-DPY0002A-MFG]  (value not drawn)
D18  ESD321DPYR  [FP-DPY0002A-MFG]  (value not drawn)
D19  ESD321DPYR  [FP-DPY0002A-MFG]  (value not drawn)
D20  ESD321DPYR  [FP-DPY0002A-MFG]  (value not drawn)
D21  ESD321DPYR  [FP-DPY0002A-MFG]  (value not drawn)
D22  SP0402U-ULC-01ETG  [FP-DPY0002A-MFG]  (value not drawn)
D23  SP0402U-ULC-01ETG  [FP-DPY0002A-MFG]  (value not drawn)
D24  SP0402U-ULC-01ETG  [FP-DPY0002A-MFG]  (value not drawn)
D25  SP0402U-ULC-01ETG  [FP-DPY0002A-MFG]  (value not drawn)
D26  SP0402U-ULC-01ETG  [FP-DPY0002A-MFG]  (value not drawn)
D27  SP0402U-ULC-01ETG  [FP-DPY0002A-MFG]  (value not drawn)
D28  SP0402U-ULC-01ETG  [FP-DPY0002A-MFG]  (value not drawn)
D29  SP0402U-ULC-01ETG  [FP-DPY0002A-MFG]  (value not drawn)
J1  BM04B-GHS-TBT(LF)(SN)  [FP-BM04B-GHS-TBT_LF_SN-MFG]
J2  BM04B-GHS-TBT(LF)(SN)  [FP-BM04B-GHS-TBT_LF_SN-MFG]
J3  BM04B-GHS-TBT(LF)(SN)  [FP-BM04B-GHS-TBT_LF_SN-MFG]
J4  BM04B-GHS-TBT(LF)(SN)  [FP-BM04B-GHS-TBT_LF_SN-MFG]
J5  BM04B-GHS-TBT(LF)(SN)  [FP-BM04B-GHS-TBT_LF_SN-MFG]
J6  BM04B-GHS-TBT(LF)(SN)  [FP-BM04B-GHS-TBT_LF_SN-MFG]
J7  BM04B-GHS-TBT(LF)(SN)  [FP-BM04B-GHS-TBT_LF_SN-MFG]
J8  BM04B-GHS-TBT(LF)(SN)  [FP-BM04B-GHS-TBT_LF_SN-MFG]
J9  BM04B-GHS-TBT(LF)(SN)  [FP-BM04B-GHS-TBT_LF_SN-MFG]
J10  TSW-105-22-G-S  [FP-TSW-105-22-G-S-MFG]
J11  BM05B-GHS-TBT (LF)(SN)(N)  [FP-BM05B-GHS-TBT_LF_SN-MFG]
J13  BM03B-GHS-TBT (LF)(SN)(N)  [FP-BM03B-GHS-TBT_LF_SN-MFG]
R13  value 3.3k  [0402_RESC1005L]  (hidden comment: Res Semi)
R14  value 3.3k  [0402_RESC1005L]  (hidden comment: Res Semi)
R15  value 3.3k  [0402_RESC1005L]  (hidden comment: Res Semi)
R16  value 3.3k  [0402_RESC1005L]  (hidden comment: Res Semi)
R17  value 3.3k  [0402_RESC1005L]  (hidden comment: Res Semi)
R18  value 3.3k  [0402_RESC1005L]  (hidden comment: Res Semi)
R36  value 0 Ω  [0402_RESC1005L]  (hidden comment: Res Semi)
R37  value 220 Ω  [0402_RESC1005L]  (hidden comment: Res Semi)
R38  value 10 kΩ  [0402_RESC1005L]  (hidden comment: Res Semi)
R39  value 10 kΩ  [0402_RESC1005L]  (hidden comment: Res Semi)
R40  value 10 kΩ  [0402_RESC1005L]  (hidden comment: Res Semi)
R41  value 10 kΩ  [0402_RESC1005L]  (hidden comment: Res Semi)
R42  value 10 kΩ  [0402_RESC1005L]  (hidden comment: Res Semi)
R43  value 65 Ω  [0603_RESC1608L]  (hidden comment: Res Semi)
R44  value 22 Ω  [0402_RESC1005L]  (hidden comment: Res Semi)
R45  value 22 Ω  [0402_RESC1005L]  (hidden comment: Res Semi)
R46  value 22 Ω  [0402_RESC1005L]  (hidden comment: Res Semi)
SW1  B3U-1000P  [FP-B3U-1000P-MFG]
U5  STM32F446RET6  [FP-LQFP64-5W-MFG]  (parts A,B of 2)
U7  ADS1220IPW  [PW16]
U8  ADS1220IPW  [PW16]
U9  ADS1220IPW  [PW16]
U10  ADS1220IPW  [PW16]
U11  CH340E  [MSOP-UN10_L]
Y1  ECS-80-12-33-JGN-TR  [XTAL_ECS-240-8-33-AGN-TR]

### Ports
3V3 (in, see main[4B], LDO_3V3[3B]), 4V3 (in, see main[4C], LDO_4V3[3B]), BATT_CURRENT (in, see main[4C], Input Connectors and Sensors[4A]), BATT_VOLTAGE (in, see main[4C], Input Connectors and Sensors[4A]), DOUT_N (in, see main[4C], USB[2D]), DOUT_P (in, see main[4C], USB[2C])

### Nets
GND: C39.2 C40.2 C41.2 C42.2 C43.2 C44.2 C45.2 C46.2 C47.2 C48.2 C50.1 C51.2 C52.2 C53.2 C54.2 C55.2 C56.2 C57.2 C58.2 C59.2 C60.2 C61.2 C62.1 C63.1 C64.2 C65.2 C66.2 C67.2 C68.2 C69.2 C70.2 C71.2 C72.2 C73.2 D4.2(GND) D5.2(GND) D6.2(GND) D7.2(GND) D8.2(GND) D9.2(GND) D10.2(GND) D11.2(GND) D12.2(GND) D13.2(GND) D14.2(GND) D15.2(GND) D16.2(GND) D17.2(GND) D18.2(GND) D19.2(GND) D20.2(GND) D21.2(GND) D22.2(GND) D23.2(GND) D24.2(GND) D25.2(GND) D26.2(GND) D27.2(GND) D28.2(GND) D29.2(GND) J1.2 J1.5(MNT_1) J1.6(MNT_2) J2.2 J2.5(MNT_1) J2.6(MNT_2) J3.2 J3.5(MNT_1) J3.6(MNT_2) J4.2 J4.5(MNT_1) J4.6(MNT_2) J5.2 J5.5(MNT_1) J5.6(MNT_2) J6.2 J6.5(MNT_1) J6.6(MNT_2) J7.2 J7.5(MNT_1) J7.6(MNT_2) J8.2 J8.5(MNT_1) J8.6(MNT_2) J9.2 J9.5(MNT_1) J9.6(MNT_2) J10.5 J11.5 J11.6(MNT_1) J11.7(MNT_2) J13.3 J13.4(MNT_1) J13.5(MNT_2) SW1.2 U5.12(VSSA/VREF-) U5.18(VSS) U5.31(VSS) U5.47(VSS) U5.63(VSS) U7.3(CLK) U7.4(DGND) U7.5(AVSS) U7.8(REFN0) U8.3(CLK) U8.4(DGND) U8.5(AVSS) U8.8(REFN0) U9.3(CLK) U9.4(DGND) U9.5(AVSS) U9.8(REFN0) U10.3(CLK) U10.4(DGND) U10.5(AVSS) U10.8(REFN0) U11.3(GND) Y1.2(GND) Y1.4(GND)
3V3: C39.1 C40.1 C41.1 C42.1 C43.1 C44.1 C45.1 C46.1 C47.1 C52.1 C53.1 C54.1 C55.1 C56.1 C57.1 C63.2 C68.1 C69.1 C70.1 C71.1 C72.1 C73.1 J1.1 J2.1 J3.1 J4.1 J5.1 J10.4 J11.1 R13.2 R14.2 R15.2 R16.2 R17.2 R18.2 R38.2 R39.2 R40.2 R41.2 R42.2 R43.1 U5.1(VBAT) U5.13(VDDA/VREF+) U5.19(VDD) U5.32(VDD) U5.48(VDD) U5.64(VDD) U7.12(AVDD) U7.13(DVDD) U8.12(AVDD) U8.13(DVDD) U9.12(AVDD) U9.13(DVDD) U10.12(AVDD) U10.13(DVDD) U11.7(VCC) U11.10(3V3) ; port 3V3
4V3: C58.1 C59.1 C60.1 C61.1 C64.1 C65.1 C66.1 C67.1 J6.1 J7.1 J8.1 J9.1 U7.9(REFP0) U8.9(REFP0) U9.9(REFP0) U10.9(REFP0) ; port 4V3
\: D21.1(IO) J13.2 U5.54(PD2)  [also labelled ESC_TEL]
BATT_CURRENT: U5.10(PC2) ; port BATT_CURRENT
BATT_VOLTAGE: U5.9(PC1) ; port BATT_VOLTAGE
BL_CTS: D19.1(IO) J11.4 U5.2(PC13)
BL_RX: D18.1(IO) J11.2 U5.52(PC11)
BL_TX: D12.1(IO) J11.3 U5.51(PC10)
BOOT0: U5.60(BOOT0)
CH340_CTS: U5.45(PA12) U11.5(CTS#)
CH340_RTS: U5.44(PA11) U11.4(RTS#)
CH340_RXD: U5.42(PA9) U11.9(RXD)
CH340_TXD: U5.43(PA10) U11.8(TXD)
CS1: R38.1 U5.38(PC7) U7.2(*CS)
CS2: R39.1 U5.37(PC6) U8.2(*CS)
CS3: R40.1 U5.36(PB15) U9.2(*CS)
CS4: R41.1 U5.35(PB14) U10.2(*CS)
DOUT_N: U11.2(UD-) ; port DOUT_N
DOUT_P: U11.1(UD+) ; port DOUT_P
ESC_PWM: D20.1(IO) J13.1 U5.28(PB2)
LC1+: D23.1(IO) J6.3 U7.11(AIN0/REFP1)
LC1-: D22.1(IO) J6.4 U7.10(AIN1)
LC2+: D25.1(IO) J7.3 U8.11(AIN0/REFP1)
LC2-: D24.1(IO) J7.4 U8.10(AIN1)
LC3+: D27.1(IO) J8.3 U9.11(AIN0/REFP1)
LC3-: D26.1(IO) J8.4 U9.10(AIN1)
LC4+: D29.1(IO) J9.3 U10.11(AIN0/REFP1)
LC4-: D28.1(IO) J9.4 U10.10(AIN1)
MISO: R45.2 U7.15(DOUT/*DRDY) U8.15(DOUT/*DRDY) U9.15(DOUT/*DRDY) U10.15(DOUT/*DRDY)
MOSI: R46.2 U7.16(DIN) U8.16(DIN) U9.16(DIN) U10.16(DIN)
NRST: C62.2 D2.1(K) D17.1(IO) J10.3 R42.1 SW1.1 U5.7(~{RST})
OSC1_N: C51.1 R37.2 Y1.3(OUT/IN)
OSC1_P: C50.2 R36.2 Y1.1(IN/OUT)
OSC_N: R37.1 U5.6(PH1-OSC_OUT)
OSC_P: R36.1 U5.5(PH0-OSC_IN)
SCK: R44.2
SCL1: D9.1(IO) D10.1(IO) D11.1(IO) J1.4 J2.4 J3.4 R14.1 U5.58(PB6)
SCL2: D13.1(IO) J4.4 R16.1 U5.29(PB10)
SCL3: D14.1(IO) J5.4 R18.1 U5.41(PA8)
SCLK: D16.1(IO) J10.2 U5.49(PA14) U7.1(SCLK) U8.1(SCLK) U9.1(SCLK) U10.1(SCLK)
SDA1: D4.1(IO) D5.1(IO) D6.1(IO) J1.3 J2.3 J3.3 R13.1 U5.59(PB7)
SDA2: D7.1(IO) J4.3 R15.1 U5.53(PC12)
SDA3: D8.1(IO) J5.3 R17.1 U5.40(PC9)
SWDIO: D15.1(IO) J10.1 U5.46(PA13)
NetC48_1: C48.1 U5.30(VCAP_1)
NetD2_2: D2.2(A) R43.2
NetR44_1: R44.1 U5.21(PA5)
NetR45_1: R45.1 U5.22(PA6)
NetR46_1: R46.1 U5.23(PA7)

Not connected (* = marked no-connect by the designer): U5 3(PC14-OSC32_IN)* 4(PC15-OSC32_OUT)* 8(PC0) 11(PC3) 14(PA0) 15(PA1) 16(PA2) 17(PA3) 20(PA4) 24(PC4) 25(PC5) 26(PB0) 27(PB1) 33(PB12) 34(PB13) 39(PC8) 50(PA15) 55(PB3) 56(PB4) 57(PB5) 61(PB8) 62(PB9); U7 6(AIN3/REFN1)* 7(AIN2)* 14(*DRDY)*; U8 6(AIN3/REFN1)* 7(AIN2)* 14(*DRDY)*; U9 6(AIN3/REFN1)* 7(AIN2)* 14(*DRDY)*; U10 6(AIN3/REFN1)* 7(AIN2)* 14(*DRDY)*; U11 6(TNOW)*

### Notes on the sheet
- (near J1) Address: 0x68
- (near J2) Address: 0x69
- (near J3) Address: 0x08
- Fast mode: 1k - 1.77k
- MP6050
- Standard mode: 1k - 4.7k
- (near C68) MT6701
- (near J10) STLink
- (near J11) Bluetooth
- (near D25) Vbr = 5v
- RTS and CTS allow UART communication at higher baud rates.
- DWG. NO.
- REV.
- SHT.
- REVISION
- DESCRIPTION
- DATE
- APPROVED
- THIS DOCUMENT AND THE DATA DISCLOSED HEREIN OR HEREWITH IS THE PROPERTY OF ALTIUM LIMITED AND MAY BE FREELY DISTRIBUTED IN WHOLE. NO RIGHTS ARE RESERVED OR EXPRESS OR IMPLIED WARANTEE GIVEN.
- ENG:
- DSN:
- APPROVALS
- PROJECT
- DOCUMENT REVISION:
- DESIGN ITEM:
- CHK:
- BOM:
- REFERENCE DOCUMENTS
- PROJECT REVISION:
- TITLE
- FAB DWG:
- PCB DWG:
- ASSY DWG:
- SCALE:
- SIZE
- C
- CAGE CODE
- FILE NAME
- DWG NO.
- SHEET
- OF
- REV

### Library data of the parts
C39-C48 C50-C62 C64-C73 = Cap Semi: Capacitor (Semiconductor SIM Model); Published: 8-Jun-2000; LatestRevisionDate: 29-May-2009; LatestRevisionNote: IPC-7351 Footprint Added.; PackageReference: C1206; Publisher: Altium Limited; PackageDescription: Chip Capacitor; Digikey part#: *; Manufacturer: *; Manufacturer part#: *
  C62: Value: 100 nF
C63 = CMP-002-000000-4: Generic CAP 0402; Value: ?F; Source: Schlib1.SchLib; Design Item ID: Generic CAP 0402
D2 = CMP-1426-00006-8: LED Uni-Color Green 572nm 2-Pin Chip 0603(1608Metric) T/R; Manufacturer Lifecycle Status: ACTIVE; Wavelength: 570nm; Forward Current: 100mA; Test Current: 20mA; YEOL: 1 = Estimated lifetime > 10 years; Forward Voltage: 2V; Max Reverse Voltage (DC): 5V; Lens Style: Clear, Rectangular; Max Junction Temperature (Tj): 95°C; Luminous Intensity: 40mcd; Viewing Angle: 140°; Power Dissipation: 72mW; Width: 800µm; REACH SVHC: Unknown; Number of Pins: 2; Max Operating Temperature: 85°C; Mount: Surface Mount; RoHS: Compliant; Case/Package: 0603; Lifecycle Status: Production; Case Code (Metric): 1608; Peak Wavelength: 572nm; Dominant Wavelength: 570nm; Length: 1.6mm; Height: 700µm; Reverse Voltage: 5V; Packaging: Tape and Reel; Color: Green; Case Code (Imperial): 0603; Min Operating Temperature: -40°C
D4-D21 = CMP-04989-000001-1: HDMI2.0 ESD PROTECTION; Manufacturer: Texas Instruments; Standoff Height: 0mm; Peak Pulse Current: 6A; Value: 0.9pF; Number Of Channels: 1; Reverse Standoff Voltage: 3.6V; Peak Pulse Power: 40W; Breakdown Voltage: 4.5V; Direction: Unidirectional; Clamping Voltage: 6.8V; RoHS: TRUE; Temperature: -40°C to +125°C; Package: DPY0002A; Temperature Range Low: -40°C; Temperature Range High: +125°C; Category: Diode; Capacitance: 0.9pF; Ambient Temperature Range Low: -40°C; Device Class L3: unset; Device Class L1: Circuit Protection; Ambient Temperature Range High: +125°C; ComponentLink2URL: http://www.ti.com/lit/ds/symlink/esd321.pdf; Octopart: https://octopart.com/esd321dpyr-texas+instruments-94354200; Manufacturer Part Number: ESD321DPYR; Digikey Description: HDMI2.0 ESD PROTECTION; Lead Free: Yes; ComponentLink2Description: Datasheet; Device Class L2: TVS Diodes; Height: 0.45mm; Automotive: No
D22-D29 = CMP-04989-000001-1: TVS DIODE 5VWM 9.2VC 0402/2DFN; Manufacturer Part Number: ESD321DPYR; Manufacturer: Texas Instruments; Standoff Height: 0mm; Peak Pulse Current: 6A; Value: 0.9pF; Number Of Channels: 1; Reverse Standoff Voltage: 3.6V; Peak Pulse Power: 40W; Breakdown Voltage: 4.5V; Direction: Unidirectional; Clamping Voltage: 6.8V; RoHS: TRUE; Temperature: -40°C to +125°C; Package: DPY0002A; Temperature Range Low: -40°C; Temperature Range High: +125°C; Category: Diode; Capacitance: 0.9pF; Ambient Temperature Range Low: -40°C; Device Class L3: unset; Device Class L1: Circuit Protection; Ambient Temperature Range High: +125°C; ComponentLink2URL: http://www.ti.com/lit/ds/symlink/esd321.pdf; Octopart: https://octopart.com/esd321dpyr-texas+instruments-94354200; Digikey Description: HDMI2.0 ESD PROTECTION; Lead Free: Yes; ComponentLink2Description: Datasheet; Device Class L2: TVS Diodes; Height: 0.45mm; Automotive: No
J1-J9 = CMP-17439-000062-2: CONN HEADER SMD 4POS 1.25MM; Number of Positions: 4; Wire/Cable Gauge: 26AWG; Current Rating: 1A; Voltage Rating (AC): 50V; Gender: Male; Orientation: Straight; Max Operating Temperature: 85°C; Pitch: 1.25mm; Contact Plating: Tin; Number of Rows: 4; Series: GH; Min Operating Temperature: -25°C; REACH SVHC: No SVHC; Packaging: Cut Tape; Lead Free: Lead Free; Voltage Rating: 50V; Contact Material: Bronze; Number of Contacts: 4; Termination: Crimp; Case/Package: SMD/SMT; Housing Color: Natural; Housing Material: Nylon
J10 = CMP-02766-000105-1: CONN HEADER VERT 5POS 2.54MM; Gender: Male; Number of Contacts: 5; Contact Plating: Gold; Mount: Through Hole; REACH SVHC: No SVHC; Number of Rows: 1; Contact Material: Bronze; Termination: Through Hole
J11 = CMP-17439-000467-1: CONN HEADER SMD 5POS 1.25MM; Pitch: 0.049inch; Number of Positions: 5; Mated Stacking Heights: 7.3mm; Voltage Rating: 50V; Contact Material: Bronze; Number of Pins: 5; Contact Type: Outer Shroud Contact; Lead Free: Lead Free; Insulation Material: Nylon; Flammability Rating: UL94 V-0; Min Operating Temperature: -25°C; Series: GH; Mount: Surface Mount; Number of Rows: 1; Color: Natural; Packaging: Cut Tape; Contact Shape: Rectangular; Contact Plating: Tin; Contact Finish - Mating: TIN; Connector Type: Header; Insulation Color: Natural; Fastening Type: Ramp; Termination: Solder; Max Operating Temperature: 85°C
J13 = CMP-17439-000616-1: CONN HEADER SMD 3POS 1.25MM; Mated Stacking Heights: 7.3mm; Voltage Rating: 50V; Pitch: 0.049inch; Number of Positions: 3; Contact Material: Bronze; Number of Rows: 1; Packaging: Cut Tape; Fastening Type: Ramp; Contact Shape: Rectangular; Termination: Solder; Flammability Rating: UL94 V-0; Lead Free: Lead Free; Color: Natural; Mount: Surface Mount; Contact Finish - Mating: TIN; Max Operating Temperature: 85°C; Series: GH; Insulation Color: Natural; Connector Type: Header; Insulation Material: Nylon; Contact Type: Outer Shroud Contact; Min Operating Temperature: -25°C; Contact Plating: Tin
R13-R18 R36-R41 R43 = Res Semi: Semiconductor Resistor; Published: 8-Jun-2000; LatestRevisionDate: 17-Jul-2002; LatestRevisionNote: Re-released for DXP Platform.; PackageReference: AXIAL-0.5; Publisher: Altium Limited; Digikey part#: *; Manufacturer: *; Manufacturer part#: *
R42 R44-R46 = Res Semi: Semiconductor Resistor 1%; Published: 8-Jun-2000; LatestRevisionDate: 17-Jul-2002; LatestRevisionNote: Re-released for DXP Platform.; PackageReference: AXIAL-0.5; Publisher: Altium Limited; Digikey part#: *; Manufacturer: *; Manufacturer part#: *
SW1 = CMP-2100-03586-2: SWITCH TACTILE SPST-NO 0.05A 12V; Contact Resistance: 100mR; Operating Force: 1.5N; Max Current Rating: 50mA; Switch Travel: 0.15mm; Actuator Type: Standard; Mechanical Life: 200000Cycles; Ratings: Dust Proof; Illumination Type: Non-Illuminated; Throw Configuration: SPST; Actuator Length: 0.4mm; Switch Function: Off-Mom; Height: 1.2mm; Width: 3mm; Weight: 0.000776oz; Contact Material: Silver; Max Voltage Rating (DC): 12V; Insulation Resistance: 100MR; Lead Free: Lead Free; Current Rating: 50mA; Termination: SMD/SMT; Length: 4mm; Voltage Rating (DC): 12V; Contact Current Rating: 50mA; Orientation: Straight; Depth: 2.5mm; Max Operating Temperature: 70°C; Packaging: Tape and Reel; Min Operating Temperature: -25°C; Package Quantity: 1; Mount: Surface Mount; Electrical Life: 200000Cycles
U5 = CMP-12105-000007-1: IC MCU 32BIT 512KB FLASH 64LQFP; Manufacturer: ST; Number Of Spi Channels: 4; Ram Size: 128KBytes; Standoff Height: 0.05mm; Number Of Uart Channels: 6; Number Of Pwm Channels: 32; Max Junction Temp: +105°C; Number Of I/Os: 50; Number Of Usb Channels: 2; Frequency: 180MHz; Number Of A/D Converters: 3; Max Supply Voltage: 3.6V; Number Of Adc Channels: 16; Interface: I2C,SPI,UART,USART,CAN,USB,LIN,IrDA,I2S,Other; Memory Size: 512KBytes; Number Of Timers/Counters: 14; Min Supply Voltage: 1.7V; Core Architecture: ARM Cortex-M4; Data Bus Width: 32bits; Number Of Cores: 1; Ambient Temperature Range Low: -40°C; ComponentLink2URL: https://www.st.com/en/microcontrollers-microprocessors/stm32f446re.html; Category: IC; Height: 1.6mm; Ipc Land Pattern Name: QFP50P1200X1200X160-64; Manufacturer Part Number: STM32F446RET6; Octopart: https://octopart.com/stm32f446ret6-stmicroelectronics-52642920; Temperature Range High: +105°C; Lead Free: Yes; Mouser Description: ARM Microcontrollers - MCU High-performance and DSP with FP, ARM Cortex-M4 MCU with 512 Kbytes Flash, 180 MHz CPU, Art Accelerator, SDRAM; Digikey Description: IC MCU 32BIT 512KB FLASH 64LQFP; Ambient Temperature Range High: +85°C; Number Of I2C Channels: 4; Memory Type: FLASH; RoHS: TRUE; Automotive: No; Device Class L1: Integrated Circuits (ICs); Temperature: -40°C to +105°C; Device Class L2: Embedded Processors and Controllers; Device Class L3: Microcontrollers; Temperature Range Low: -40°C; Package: LQFP64-5W; ComponentLink2Description: Datasheet
U7-U10 = ADS1220IPW: 24-bit, 2-kSPS, four-channel, low-power, delta-sigma ADC with PGA, VREF, SPI and two IDACs 16-TSSOP -40 to 125; Manufacturer_Name: Texas Instruments; Copyright: Copyright (C) 2025 Ultra Librarian. All rights reserved.; Manufacturer_Part_Number: ADS1220IPW; RefDes: RefDes; Type: Type
U11 = CMP-010-000001-1: Source: Schlib1.SchLib; Design Item ID: CH340E
Y1 = ECS-80-12-33-JGN-TR: 8 MHz Â±20ppm Crystal 12pF 400 Ohms 4-SMD, No Lead; MF: ECS Inc.; SnapEDA_Link: https://www.snapeda.com/parts/ECS-80-12-33-JGN-TR/ECS/view-part/?ref=snap; Package: ECX-32-33-4 ECS; Value: *; MP: ECS-80-12-33-JGN-TR; Check_prices: https://www.snapeda.com/parts/ECS-80-12-33-JGN-TR/ECS/view-part/?ref=eda

## Sheet LDO_4V3.SchDoc
size A4; SheetNumber: 7; SheetTotal: 8; SPICEModelCacheGQKPAAKM: <root> / <DocumentId>GQKPAAKM</DocumentId> / <CacheFrame Number="0"> / <Model Name="cap" Kind="MDL"> / <Text>*Default semiconductor capacitor / .MODEL CAP C()</Text> / </Model> / <Model Name="res" Kind="MDL"> / <Text>*Default semiconductor resistor / .MODEL RES R()</Text> / </Model> / </CacheFrame> / </root>
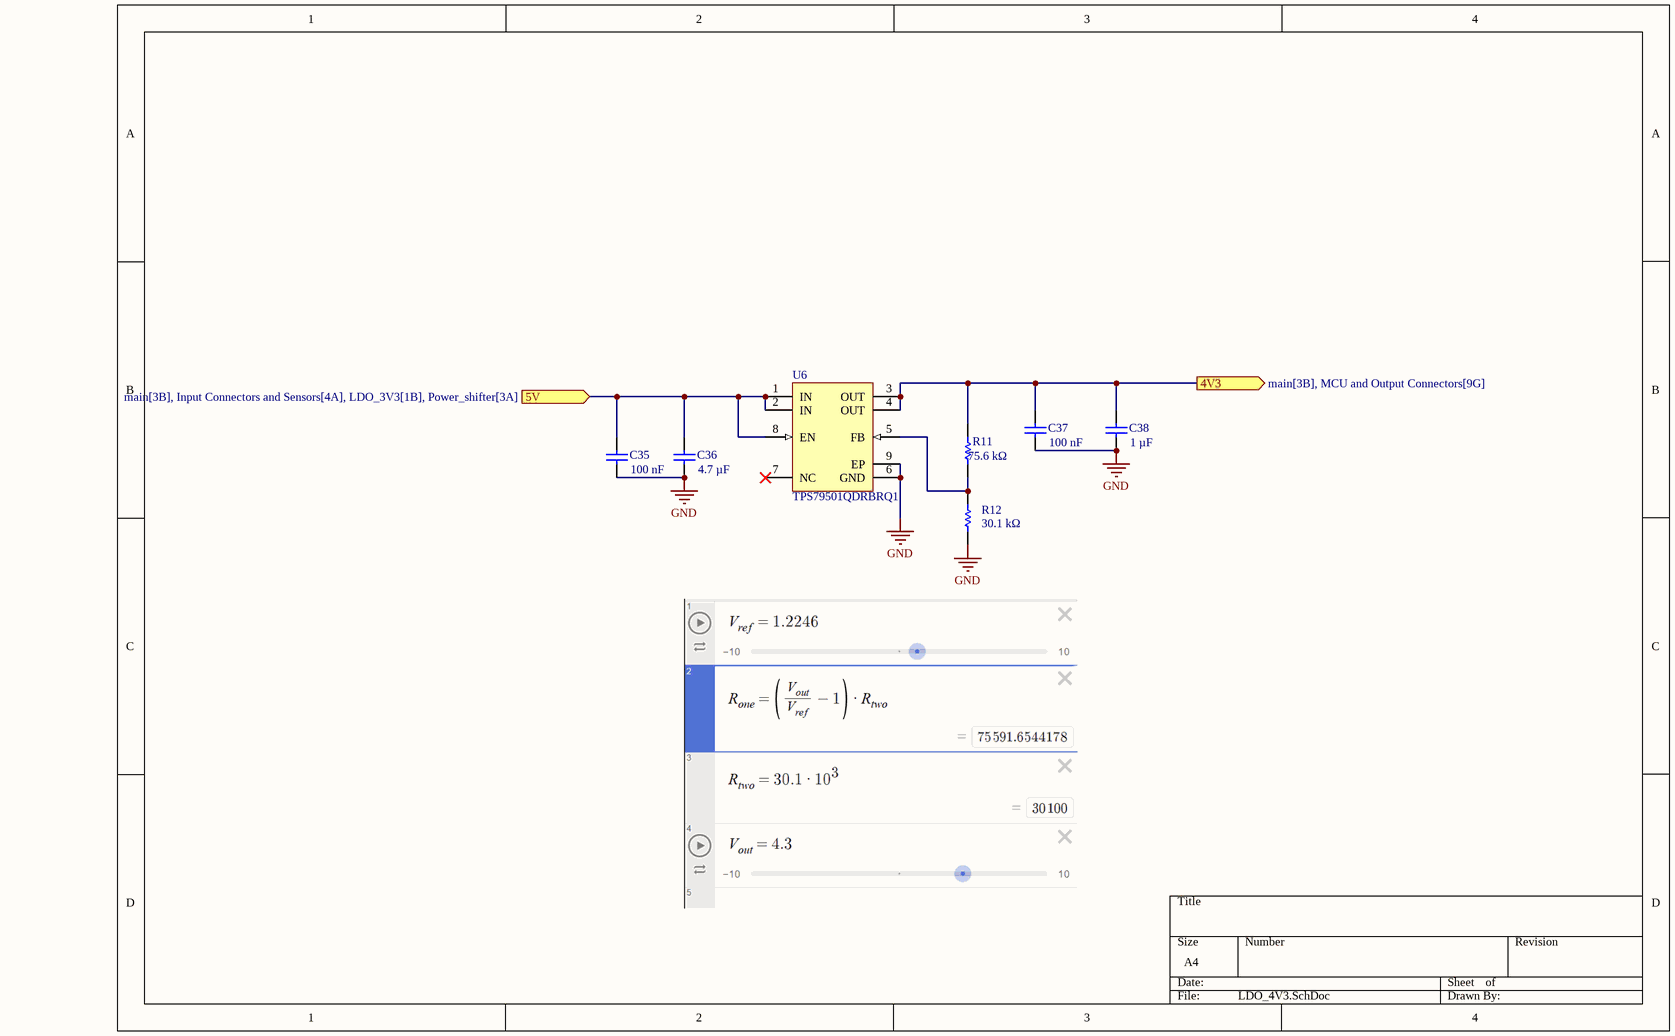
[diagram p8: LDO_4V3.SchDoc]

### Parts
C35  value 100 nF  [0402_CAPC1005L]  (hidden comment: Cap Semi)
C36  value 4.7 µF  [0805_CAPC2012L]  (hidden comment: Cap Semi)
C37  value 100 nF  [0402_CAPC1005L]  (hidden comment: Cap Semi)
C38  value 1 µF  [0805_CAPC2012L]  (hidden comment: Cap Semi)
R11  value 75.6 kΩ  [0402_RESC1005L]  (hidden comment: Res Semi)
R12  value 30.1 kΩ  [0402_RESC1005L]  (hidden comment: Res Semi)
U6  TPS79501QDRBRQ1  [DRB0008B_V]

### Ports
4V3 (out, see main[3B], MCU and Output Connectors[9G]), 5V (in, see main[3B], Input Connectors and Sensors[4A], LDO_3V3[1B], Power_shifter[3A])

### Nets
GND: C35.1 C36.1 C37.1 C38.1 R12.1 U6.6(GND) U6.9(EP)
4V3: C37.2 C38.2 R11.2 U6.3(OUT) U6.4(OUT) ; port 4V3
5V: C35.2 C36.2 U6.1(IN) U6.2(IN) U6.8(EN) ; port 5V
NetR11_1: R11.1 R12.2 U6.5(FB)

Not connected (* = marked no-connect by the designer): U6 7(NC)*

### Library data of the parts
C35-C38 = Cap Semi: Capacitor (Semiconductor SIM Model); Published: 8-Jun-2000; LatestRevisionDate: 29-May-2009; LatestRevisionNote: IPC-7351 Footprint Added.; PackageReference: C1206; Publisher: Altium Limited; PackageDescription: Chip Capacitor; Digikey part#: *; Manufacturer: *; Manufacturer part#: *
R11 R12 = Res Semi: Semiconductor Resistor; Published: 8-Jun-2000; LatestRevisionDate: 17-Jul-2002; LatestRevisionNote: Re-released for DXP Platform.; PackageReference: AXIAL-0.5; Publisher: Altium Limited; Digikey part#: *; Manufacturer: *; Manufacturer part#: *
U6 = CMP-0395-00646-2: Single Output High PSRR LDO, 500 mA, Adjustable 1.2 to 5.5 V Output, 2.7 to 5.5 V Input, 8-pin SON (DRB), -40 to 125 degC, Green (RoHS & no Sb/Br); Manufacturer: Texas Instruments; Vout Adj(Max)(V): 5.5; Iout(Max)(A): 0.5; Vdo(Typ)(mV): 110; Accuracy(%): 2; SubFamily: Single Channel LDO; Vout Adj(Min)(V): 1.2; Vin(Min)(V): 2.7; Iq(Typ)(mA): 0.26; Rating: Automotive; ComponentLink3URL: http://www.ti.com/litv/pdf/mpds118h; DatasheetVersion: SLVSAJ9; Vin(Max)(V): 5.5; Mounting Technology: Surface Mount; ComponentLink1Description: Manufacturer URL; ComponentLink1URL: http://www.ti.com/; Eco-Plan: Green (RoHS & no Sb/Br); ComponentLink2URL: http://www.ti.com/general/docs/lit/getliterature.tsp?genericPartNumber=TPS79501-Q1&fileType=pdf; PartNumber: TPS79501QDRBRQ1; PackageVersion: 4203482-2/K; PackageReference: DRB0008B; PackageDescription: 8-Pin Plastic Small Outline, Body 3 x 3 mm, Pitch 0.65 mm; ComponentLink2Description: Datasheet; ComponentLink3Description: Package Specification

## Sheet USB.SchDoc
size A4; SheetNumber: 4; SheetTotal: 7
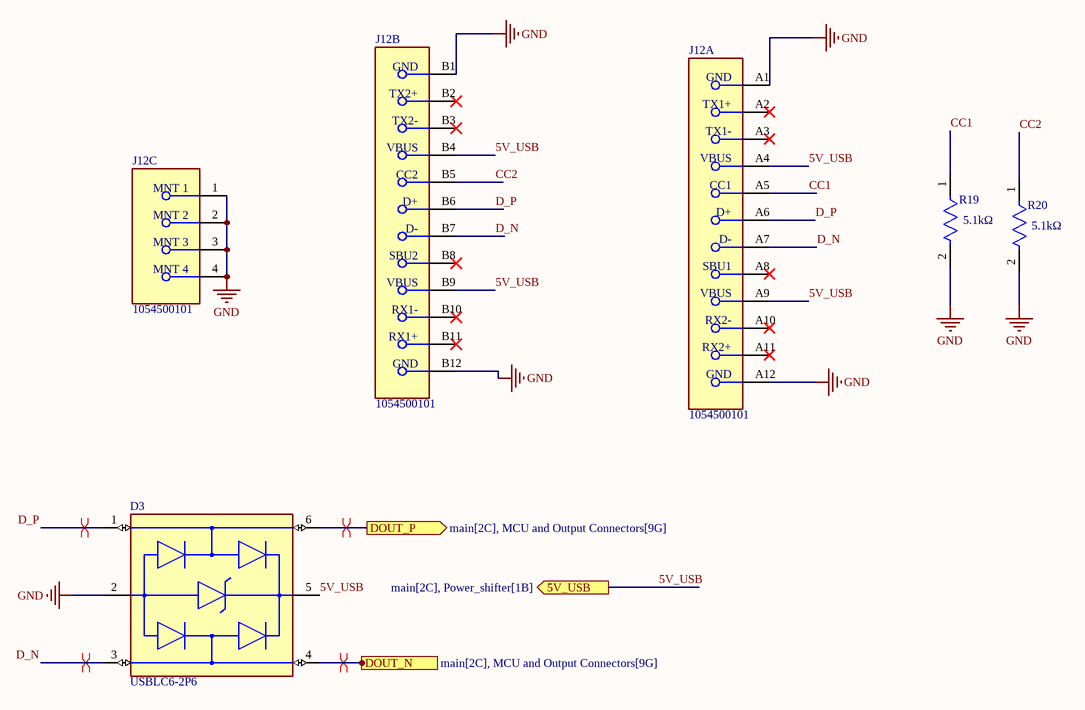
[diagram p9: USB.SchDoc]

### Parts
D3  USBLC6-2P6  [FP-SOT-666-MFG]
J12  1054500101  [FP-1054500101-MFG]  (parts A,B,C of 3)
R19  Resistance: 5.1kΩ  [FP-MCWR04-IPC_C]  (hidden comment: MCWR04X5101FTL)
R20  Resistance: 5.1kΩ  [FP-MCWR04-IPC_C]  (hidden comment: MCWR04X5101FTL)

### Ports
5V_USB (out, see main[2C], Power_shifter[1B]), DOUT_N (out, see main[2C], MCU and Output Connectors[9G]), DOUT_P (out, see main[2C], MCU and Output Connectors[9G])

### Nets
GND: D3.2(GND) J12.1(MNT_1) J12.2(MNT_2) J12.3(MNT_3) J12.4(MNT_4) J12.A1(GND) J12.A12(GND) J12.B1(GND) J12.B12(GND) R19.2 R20.2
5V_USB: D3.5(VBUS) J12.A4(VBUS) J12.A9(VBUS) J12.B4(VBUS) J12.B9(VBUS) ; port 5V_USB
CC1: J12.A5(CC1) R19.1
CC2: J12.B5(CC2) R20.1
D_N: D3.3(I/O2) J12.A7(D-) J12.B7(D-)
D_P: D3.1(I/O1) J12.A6(D+) J12.B6(D+)
DOUT_N: D3.4(I/O2) ; port DOUT_N
DOUT_P: D3.6(I/O1) ; port DOUT_P

Not connected (* = marked no-connect by the designer): J12 A2(TX1+)* A3(TX1-)* A8(SBU1)* A10(RX2-)* A11(RX2+)* B2(TX2+)* B3(TX2-)* B8(SBU2)* B10(RX1-)* B11(RX1+)*

### Layout directives
differential pair: D_N, D_P, DOUT_N, DOUT_P

### Library data of the parts
D3 = CMP-12225-000058-1: TVS DIODE 5.25V 17V SOT666; Min Breakdown Voltage: 6V; Power Line Protection: Yes; Element Configuration: Dual; Test Current: 1mA; Working Voltage: 5V; Number of Channels: 2; Max Reverse Leakage Current: 150nA; Direction: Unidirectional; Peak Pulse Current: 5A; Number of Elements: 1; Capacitance: 3.5pF; Max Breakdown Voltage: 6V; Height: 0.6mm; Depth: 1.3mm; Contact Plating: Tin; Reverse Breakdown Voltage: 6V; REACH SVHC: No SVHC; Operating Supply Voltage: 5V; Width: 1.3mm; Max Operating Temperature: 125°C; Reverse Standoff Voltage: 5V; ESD Protection: Yes; Package Quantity: 1; Termination: SMD/SMT; Length: 1.7mm; Leakage Current: 150nA; Number of Bidirectional Channels: 2; Case/Package: SOT-666; Min Operating Temperature: -40°C; Number of Pins: 6; Clamping Voltage: 17V; Breakdown Voltage: 6V; Lead Free: Lead Free; Radiation Hardening: No; Packaging: Tape and Reel; Mount: Surface Mount; Polarity: Unidirectional
J12 = CMP-04767-000004-1: CONN RCP USB3.1 TYPEC 24P SMD RA; Manufacturer: Molex; Number Of Contacts: 24; Voltage Rating: 30V; Shielding: true; Is Female: yes; Current Rating: 0.25/1.25/5A; Pitch: 0.5mm; Conn Orientation: Right Angle; Package: 0; Height: 3.44mm; Footprint Url: https://www.molex.com/pdm_docs/sd/1054500101_sd.pdf; Device Class L1: Connectors; Category: Conn; Device Class L2: USB Connectors; Digikey Description: CONN RCP USB3.1 TYPEC 24P SMD RA; Contact Material: Gold,Nickel; Mouser Description: USB Shielded I/O Receptacle; Type C; Right Angle; Surface Mount; Gold over Nickel; ComponentLink2Description: Datasheet; Lead Free: Yes; Automotive: No; Temperature Range High: +85°C; RoHS: TRUE; Octopart: https://octopart.com/105450-0101-molex-68082325; ComponentLink2URL: https://www.molex.com/webdocs/datasheets/pdf/en-us/1054500101_IO_CONNECTORS.pdf; Temperature: -30°C to +85°C; Usb Standard: USB 3.1; Temperature Range Low: -30°C; Device Class L3: unset; Manufacturer Part Number: 1054500101
R19 R20 = CMP-12256-000001-1: RES 5.1 kohm, 62.5 mW, 1%, 50 V; Manufacturer: Multicomp Pro; Value: 5.1kΩ; Voltage Rating: 50V; Power Rating: 62.5mW; Temperature Coefficient: 100ppm/°C; ComponentLink2Description: Datasheet; Lead Free: Yes; Device Class L1: Passive Components; Ambient Temperature Range High: +125°C; Manufacturer Part Number: MCWR04X5101FTL; Octopart: https://octopart.com/mcwr04x5101ftl-multicomp-50550258; Tolerance: 1%; Category: Res; Device Class L2: Resistors; Device Class L3: Chip SMD Resistors; Ambient Temperature Range Low: -55°C; Height: 0.4mm; Composition: Thick Film; ComponentLink2URL: http://www.farnell.com/datasheets/2860681.pdf; Ipc Land Pattern Name: RESC10050X35; Package: MCWR04; RoHS: TRUE; Automotive: No; Series: MCWR

## Sheet Power_shifter.SchDoc
size A4; SheetNumber: 5; SheetTotal: 7; SPICEModelCacheWVRGNQJF: <root> / <DocumentId>WVRGNQJF</DocumentId> / <CacheFrame Number="0"> / <Model Name="res" Kind="MDL"> / <Text>*Default semiconductor resistor / .MODEL RES R()</Text> / </Model> / <Model Name="cap" Kind="MDL"> / <Text>*Default semiconductor capacitor / .MODEL CAP C()</Text> / </Model> / </CacheFrame> / </root>
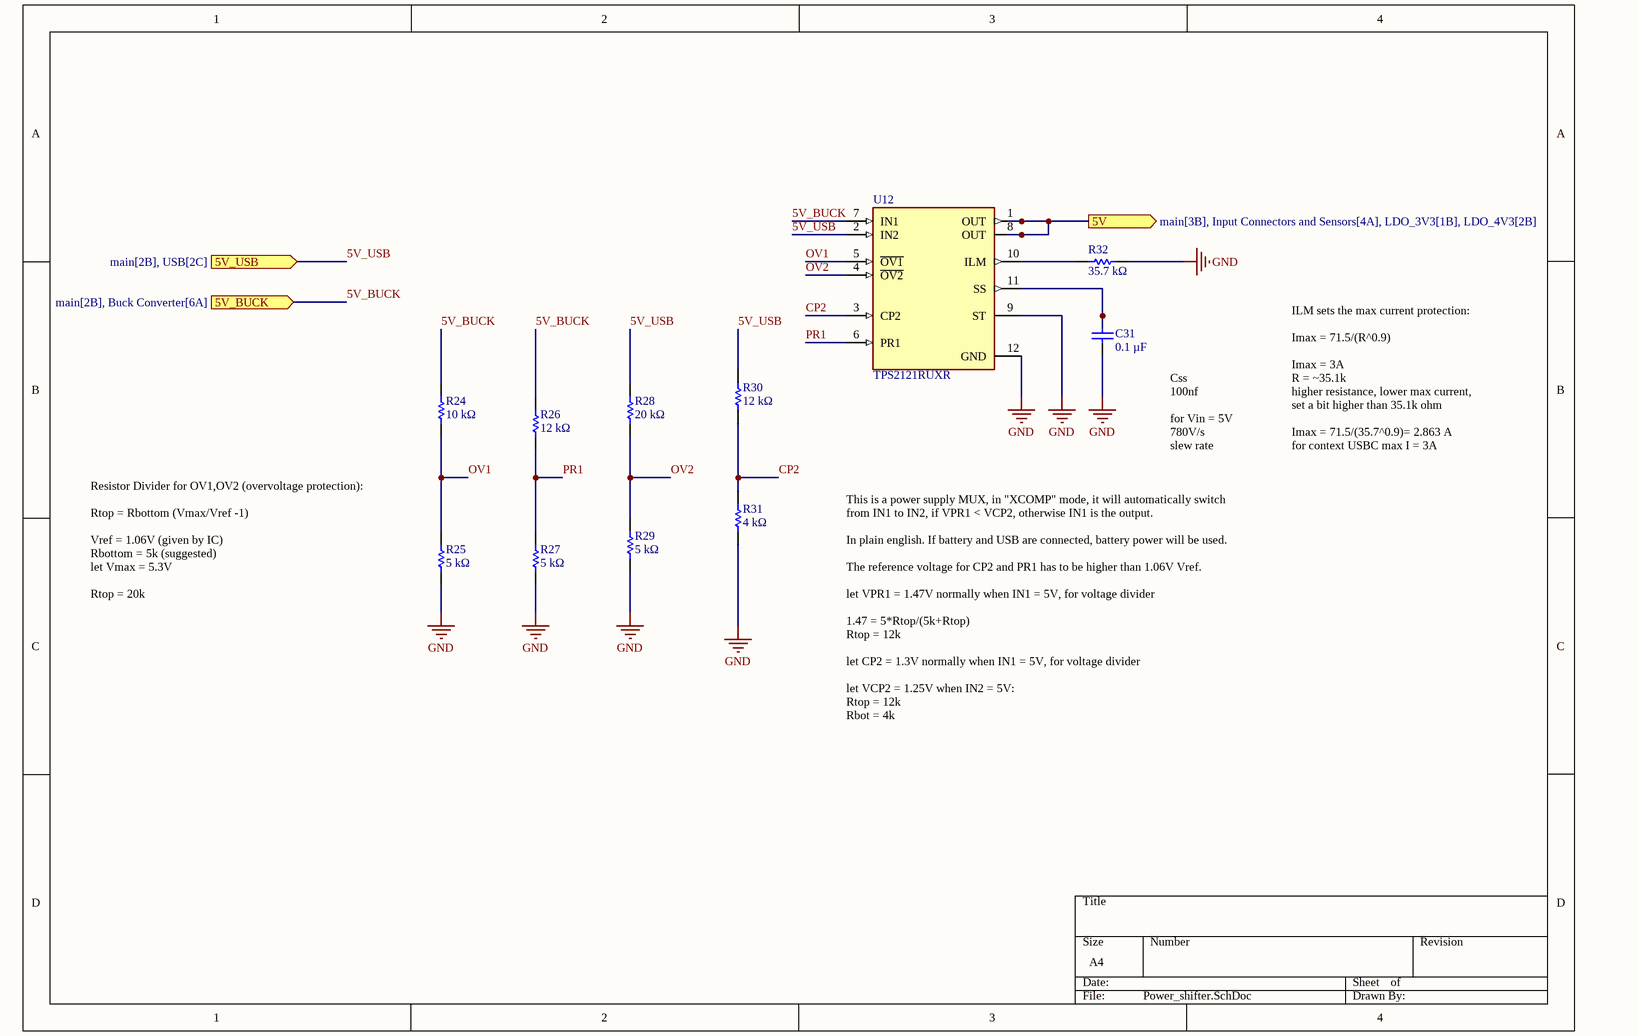
[diagram p10: Power_shifter.SchDoc]

### Parts
C31  0.1 µF  [0402_CAPC1005L]
R24  value 10 kΩ  [0402_RESC1005L]  (hidden comment: Res Semi)
R25  value 5 kΩ  [0402_RESC1005L]  (hidden comment: Res Semi)
R26  value 12 kΩ  [0402_RESC1005L]  (hidden comment: Res Semi)
R27  value 5 kΩ  [0402_RESC1005L]  (hidden comment: Res Semi)
R28  value 20 kΩ  [0402_RESC1005L]  (hidden comment: Res Semi)
R29  value 5 kΩ  [0402_RESC1005L]  (hidden comment: Res Semi)
R30  value 12 kΩ  [0402_RESC1005L]  (hidden comment: Res Semi)
R31  value 4 kΩ  [0402_RESC1005L]  (hidden comment: Res Semi)
R32  value 35.7 kΩ  [0402_RESC1005L]  (hidden comment: Res Semi)
U12  TPS2121RUXR  [FP-RUX0012A-MFG]

### Ports
5V (out, see main[3B], Input Connectors and Sensors[4A], LDO_3V3[1B], LDO_4V3[2B]), 5V_BUCK (in, see main[2B], Buck Converter[6A]), 5V_USB (in, see main[2B], USB[2C])

### Nets
GND: C31.2 R25.1 R27.1 R29.1 R31.1 R32.1 U12.9(ST) U12.12(GND)
5V: U12.1(OUT) U12.8(OUT) ; port 5V
5V_BUCK: R24.2 R26.2 U12.7(IN1) ; port 5V_BUCK
5V_USB: R28.2 R30.2 U12.2(IN2) ; port 5V_USB
CP2: R30.1 R31.2 U12.3(CP2)
OV1: R24.1 R25.2 U12.5(~{OV1})
OV2: R28.1 R29.2 U12.4(~{OV2})
PR1: R26.1 R27.2 U12.6(PR1)
NetC31_1: C31.1 U12.11(SS)
NetR32_2: R32.2 U12.10(ILM)

### Notes on the sheet
- ILM sets the max current protection:
  Imax = 71.5/(R^0.9)
  Imax = 3A
  R = ~35.1k
  higher resistance, lower max current,
  set a bit higher than 35.1k ohm
  Imax = 71.5/(35.7^0.9)= 2.863 A
  for context USBC max I = 3A
- Css
  100nf
  for Vin = 5V
  780V/s
  slew rate
- Resistor Divider for OV1,OV2 (overvoltage protection):
  Rtop = Rbottom (Vmax/Vref -1)
  Vref = 1.06V (given by IC)
  Rbottom = 5k (suggested)
  let Vmax = 5.3V
  Rtop = 20k
- This is a power supply MUX, in "XCOMP" mode, it will automatically switch from IN1 to IN2, if VPR1 < VCP2, otherwise IN1 is the output.
  In plain english. If battery and USB are connected, battery power will be used.
  The reference voltage for CP2 and PR1 has to be higher than 1.06V Vref.
  let VPR1 = 1.47V normally when IN1 = 5V, for voltage divider
  1.47 = 5*Rtop/(5k+Rtop)
  Rtop = 12k
  let CP2 = 1.3V normally when IN1 = 5V, for voltage divider
  let VCP2 = 1.25V when IN2 = 5V:
  Rtop = 12k
  Rbot = 4k
  therefore, when IN2 = 5V, it will switch to IN2 when IN1 = 4.25V

### Library data of the parts
C31 = Cap Semi: Capacitor (Semiconductor SIM Model); Published: 8-Jun-2000; LatestRevisionDate: 29-May-2009; LatestRevisionNote: IPC-7351 Footprint Added.; PackageReference: C1206; Publisher: Altium Limited; PackageDescription: Chip Capacitor; Digikey part#: *; Manufacturer: *; Manufacturer part#: *; Value: 0.1 µF
R24-R32 = Res Semi: Semiconductor Resistor; Published: 8-Jun-2000; LatestRevisionDate: 17-Jul-2002; LatestRevisionNote: Re-released for DXP Platform.; PackageReference: AXIAL-0.5; Publisher: Altium Limited; Digikey part#: *; Manufacturer: *; Manufacturer part#: *
U12 = CMP-04910-000009-1: PWR MGMT BATTERY MGMT; Manufacturer: Texas Instruments; Min Supply Voltage: 2.8V; Max Junction Temp: +125°C; Output Voltage: 22V; Output Current: 1.5-5.2A; Standoff Height: 0mm; Number Of Outputs: 1; Nominal Supply Current: 300uA; Device Class L2: Power Management ICs; Octopart: https://octopart.com/tps2121ruxr-texas+instruments-95511053; Mouser Description: 2.7-22V, 56m?, 4.5A, Priority Power MUX with Seamless Switchover 12-VQFN-HR -40 to 125; Lead Free: Yes; Digikey Description: PWR MGMT BATTERY MGMT; Manufacturer Part Number: TPS2121RUXR; Height: 1mm; Device Class L1: Integrated Circuits (ICs); Category: IC; Max Supply Voltage: 22V; ComponentLink2Description: Datasheet; Temperature: -40°C to +125°C; Temperature Range High: +125°C; ComponentLink2URL: https://www.ti.com/lit/ds/symlink/tps2121.pdf; Automotive: No; Package: RUX0012A; RoHS: TRUE; Device Class L3: unset; Temperature Range Low: -40°C

## Nets that join several sheets
GND: Input Connectors and Sensors (9 pins), Buck Converter (19 pins), LDO_3V3 (10 pins), MCU and Output Connectors (119 pins), LDO_4V3 (7 pins), USB (11 pins), Power_shifter (8 pins)
3V3: LDO_3V3 (5 pins), MCU and Output Connectors (57 pins)
4V3: MCU and Output Connectors (16 pins), LDO_4V3 (5 pins)
5V: LDO_3V3 (5 pins), LDO_4V3 (5 pins), Power_shifter (U12.1 U12.8)
5V_BUCK: Buck Converter (10 pins), Power_shifter (R24.2 R26.2 U12.7)
5V_USB: USB (5 pins), Power_shifter (R28.2 R30.2 U12.2)
BATT_CURRENT: Input Connectors and Sensors (U2.8), MCU and Output Connectors (U5.10)
BATT_IN: Input Connectors and Sensors (5 pins), Buck Converter (8 pins)
BATT_VOLTAGE: Input Connectors and Sensors (U1.1 U1.4), MCU and Output Connectors (U5.9)
DOUT_N: MCU and Output Connectors (U11.2), USB (D3.4)
DOUT_P: MCU and Output Connectors (U11.1), USB (D3.6)